# EasyEDA Pro project ProPrj_StarrySkyPi_2025-06-18.epro, schematic Schematic1, sheets 1 to 5 of 7

## Sheets
1 设计概览: Board Name: Board1; Create Date: 2025-06-05; Page Name: 设计概览; Project Name: StarrySkyPi; Schematic Name: Schematic1; Update Date: 2025-06-05; Company: 嘉立创EDA; Page Size: A4; Version: V1.0
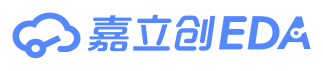
[diagram p0: 设计概览]
2 电源模块: Page Name: 电源模块
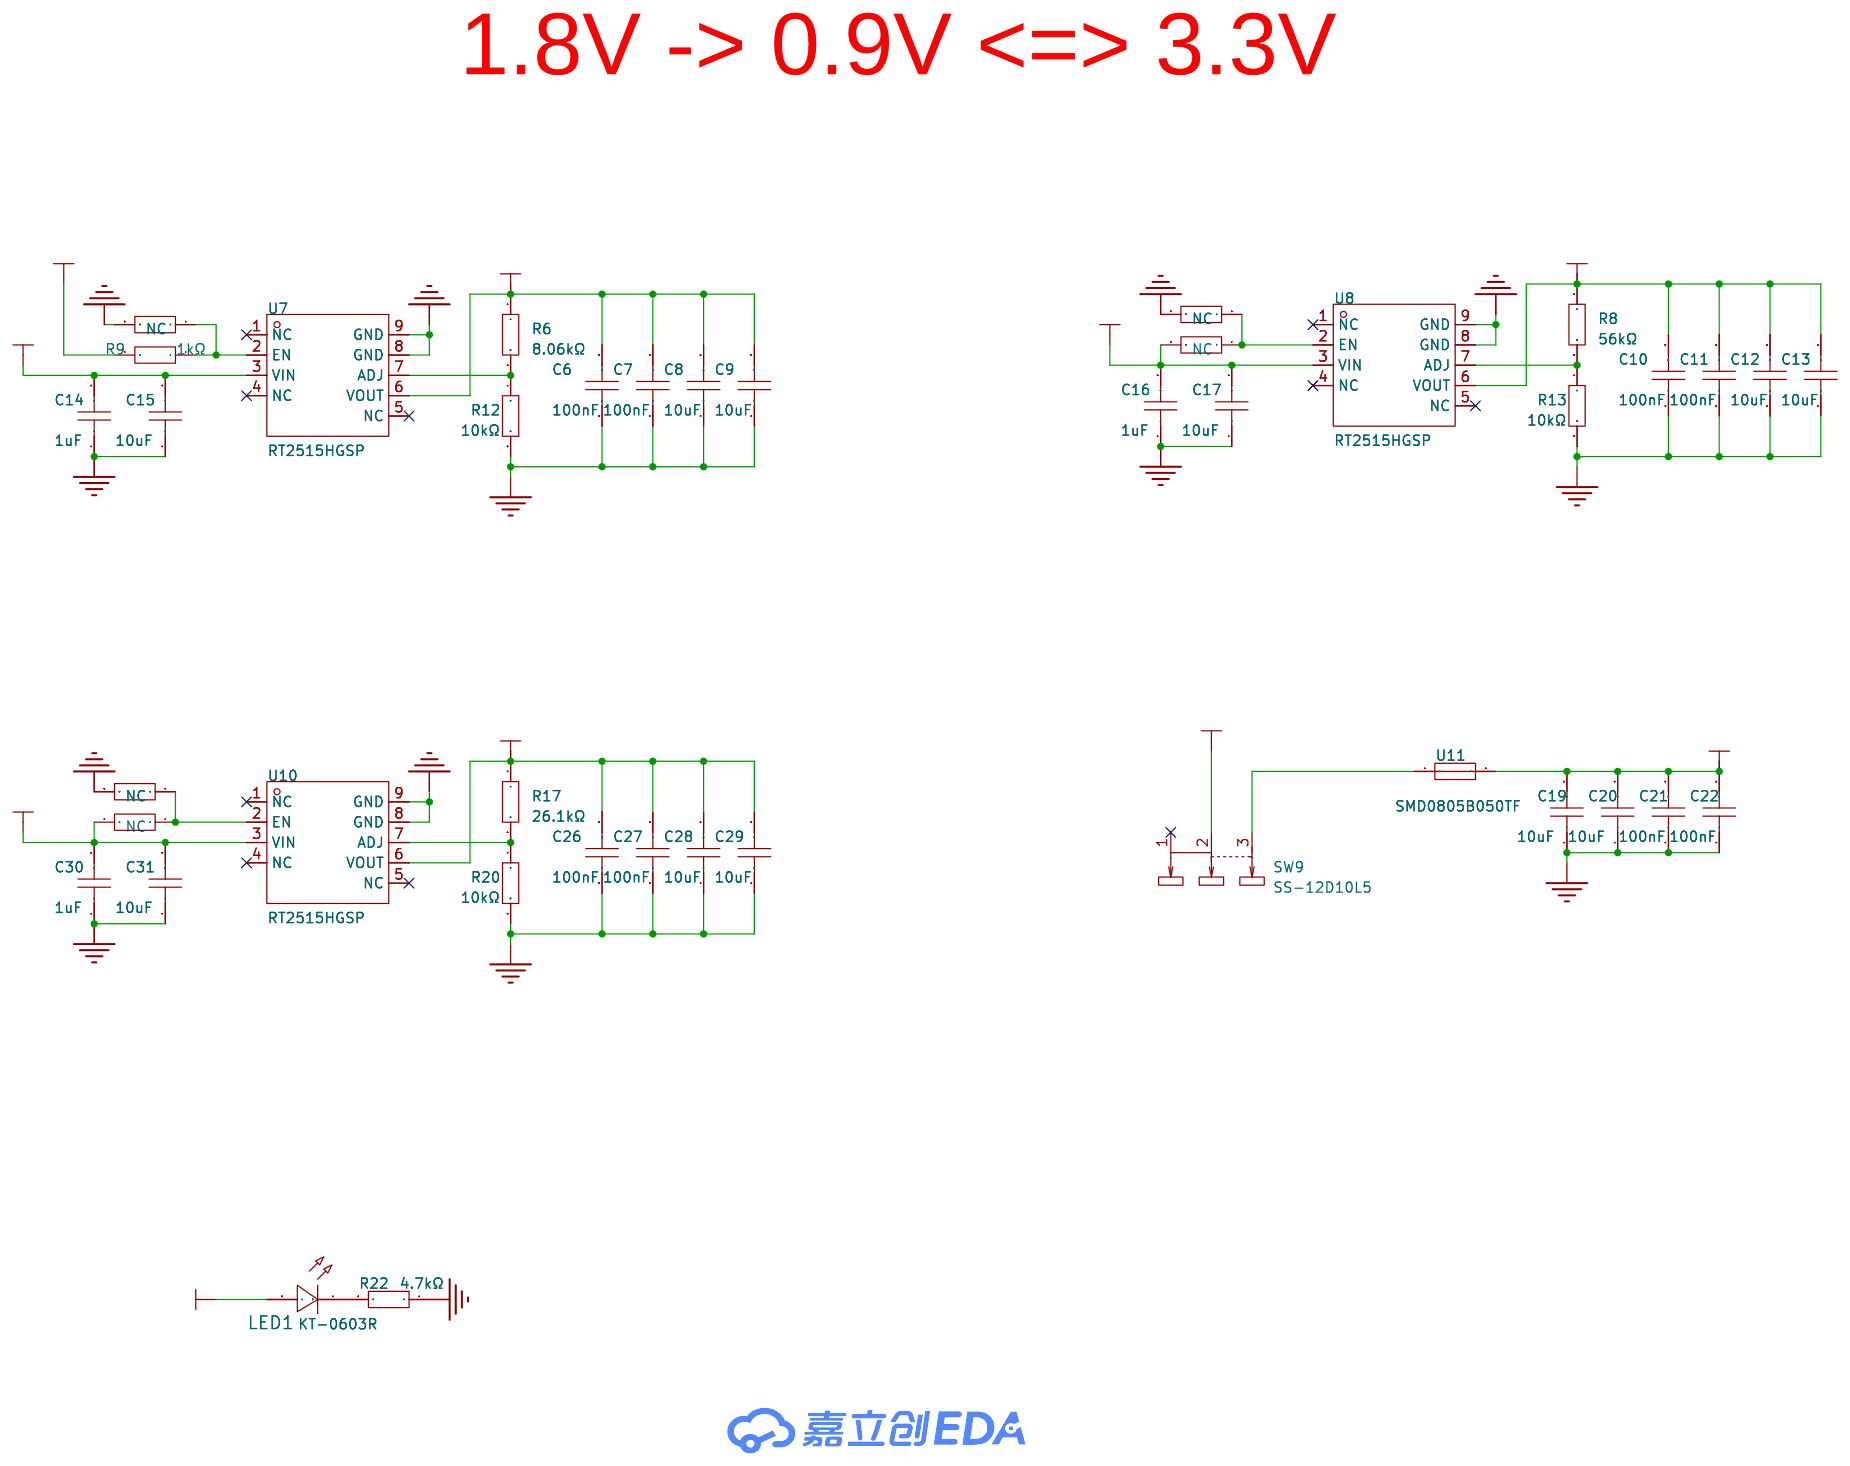
[diagram p1: 电源模块]
3 芯片外围: Page Name: 芯片外围
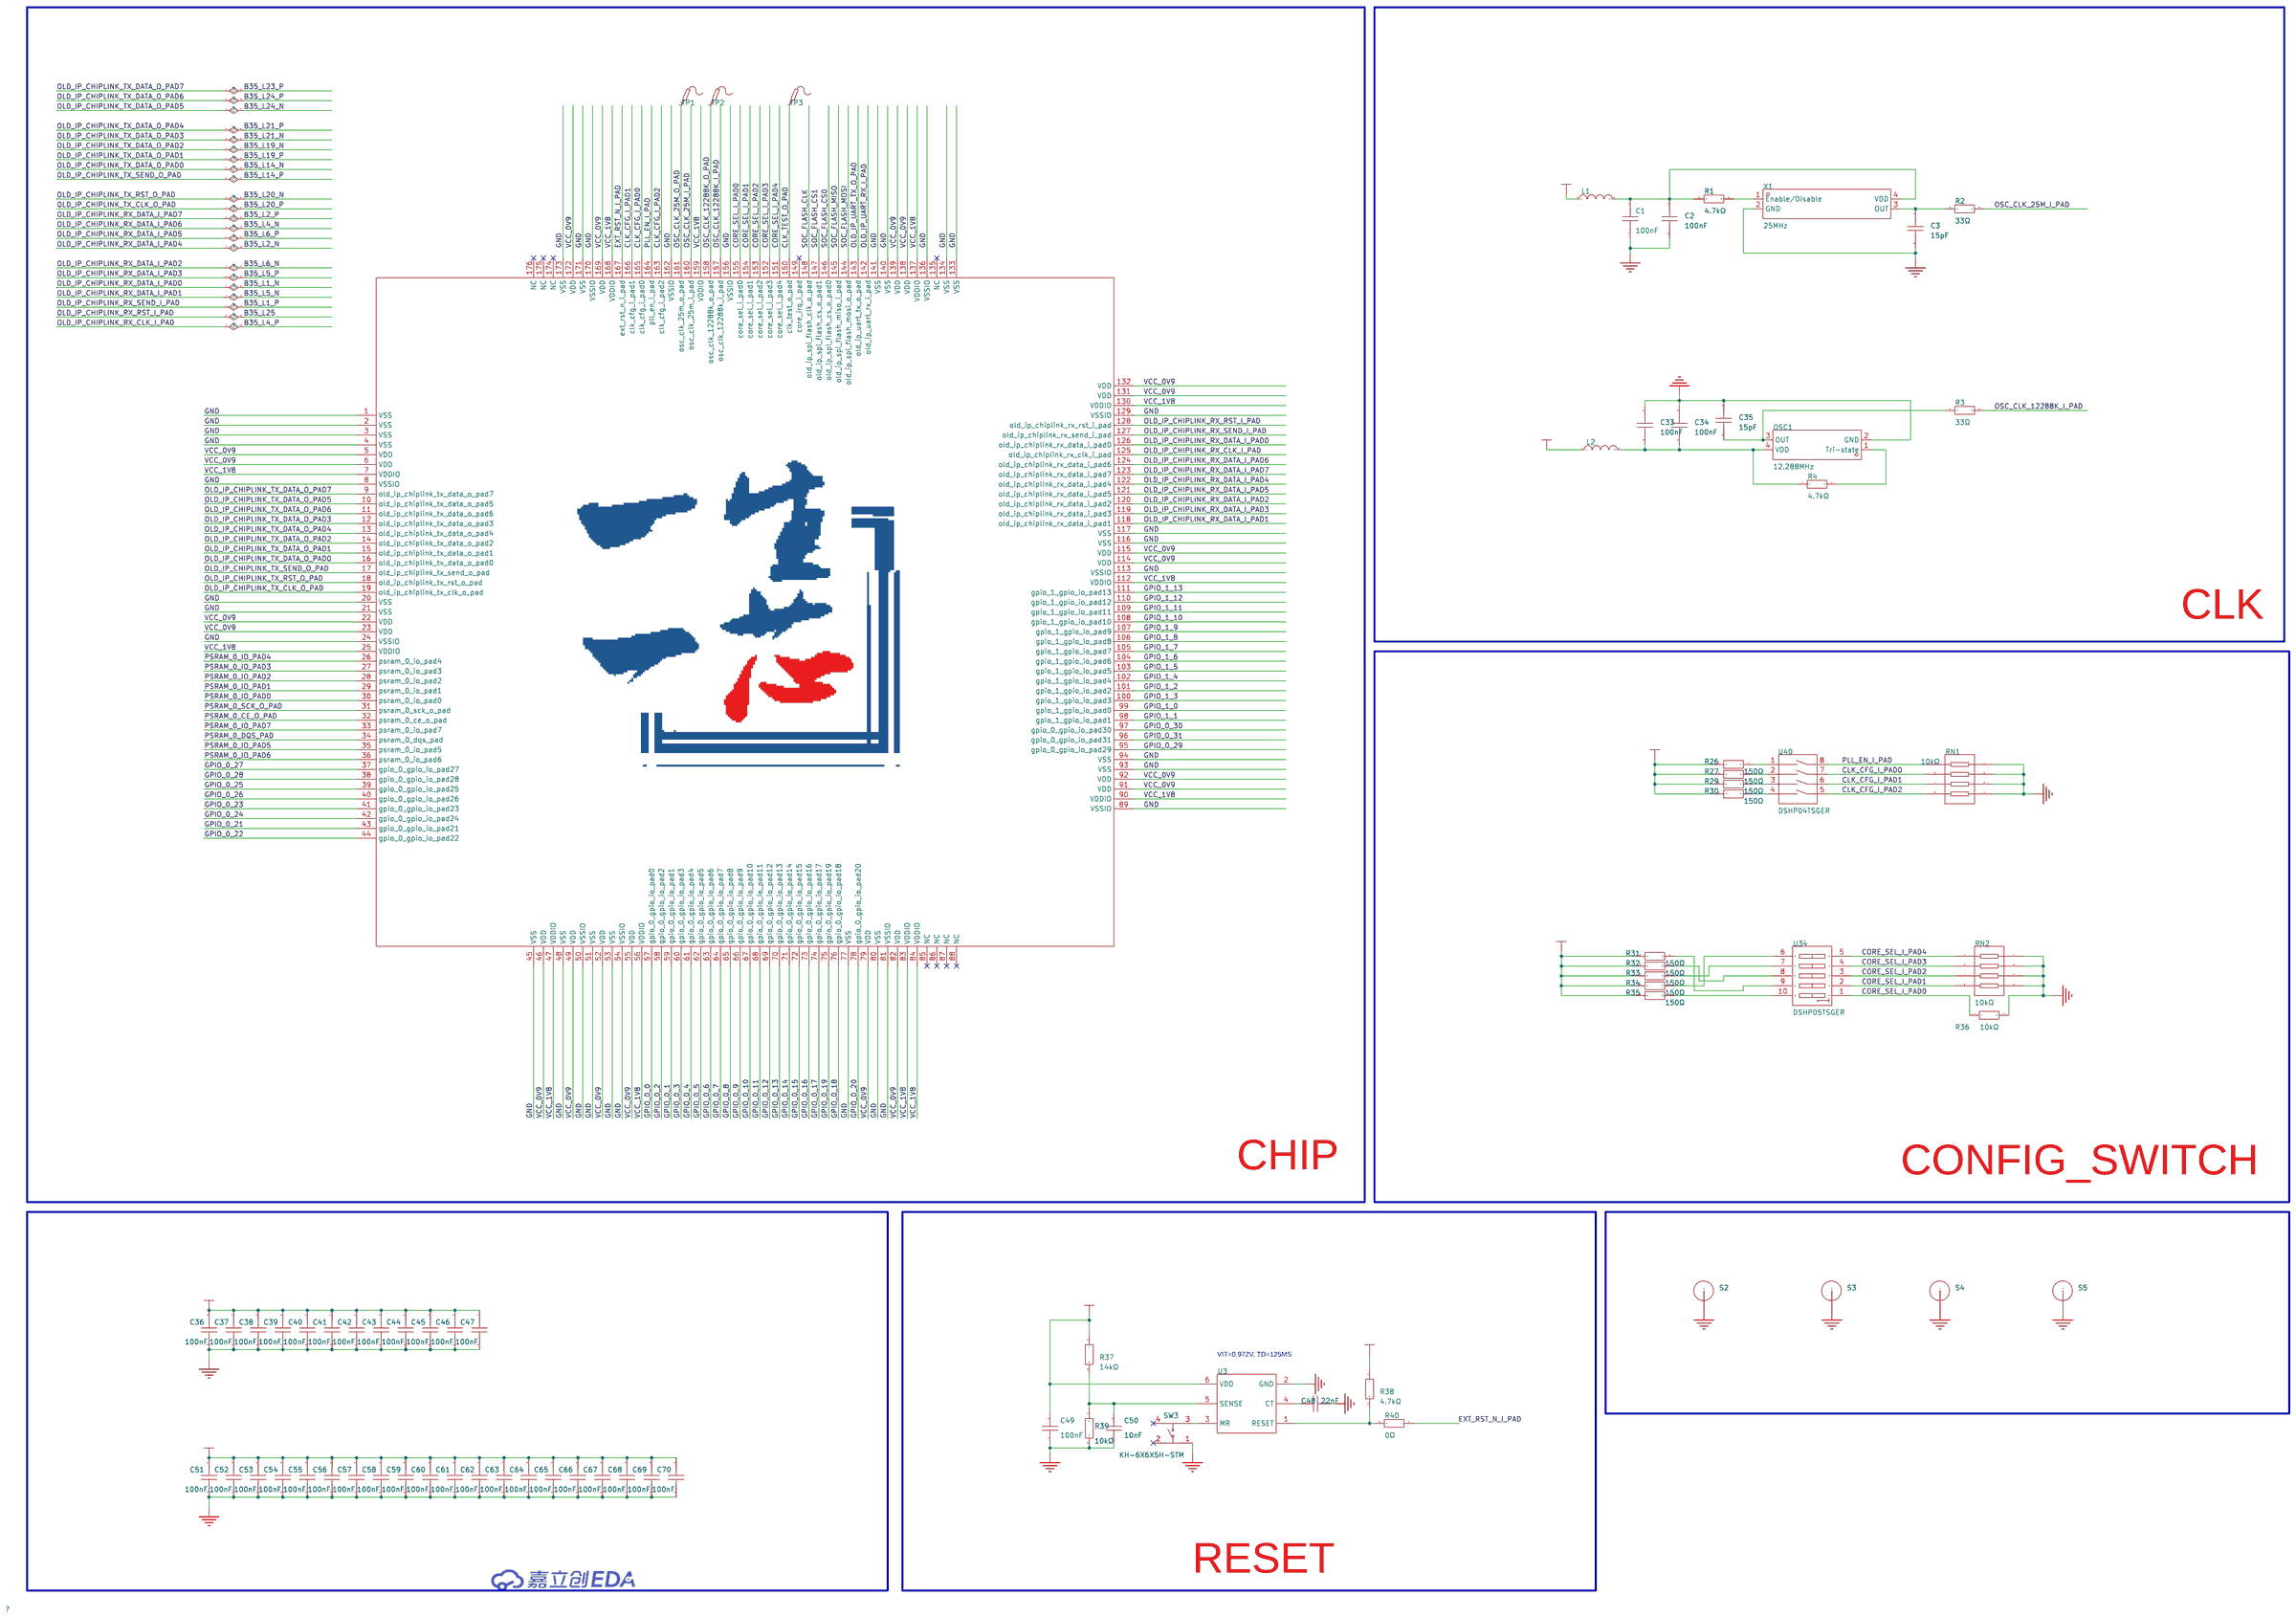
[diagram p2: 芯片外围]
4 FPGA外围: Page Name: FPGA外围
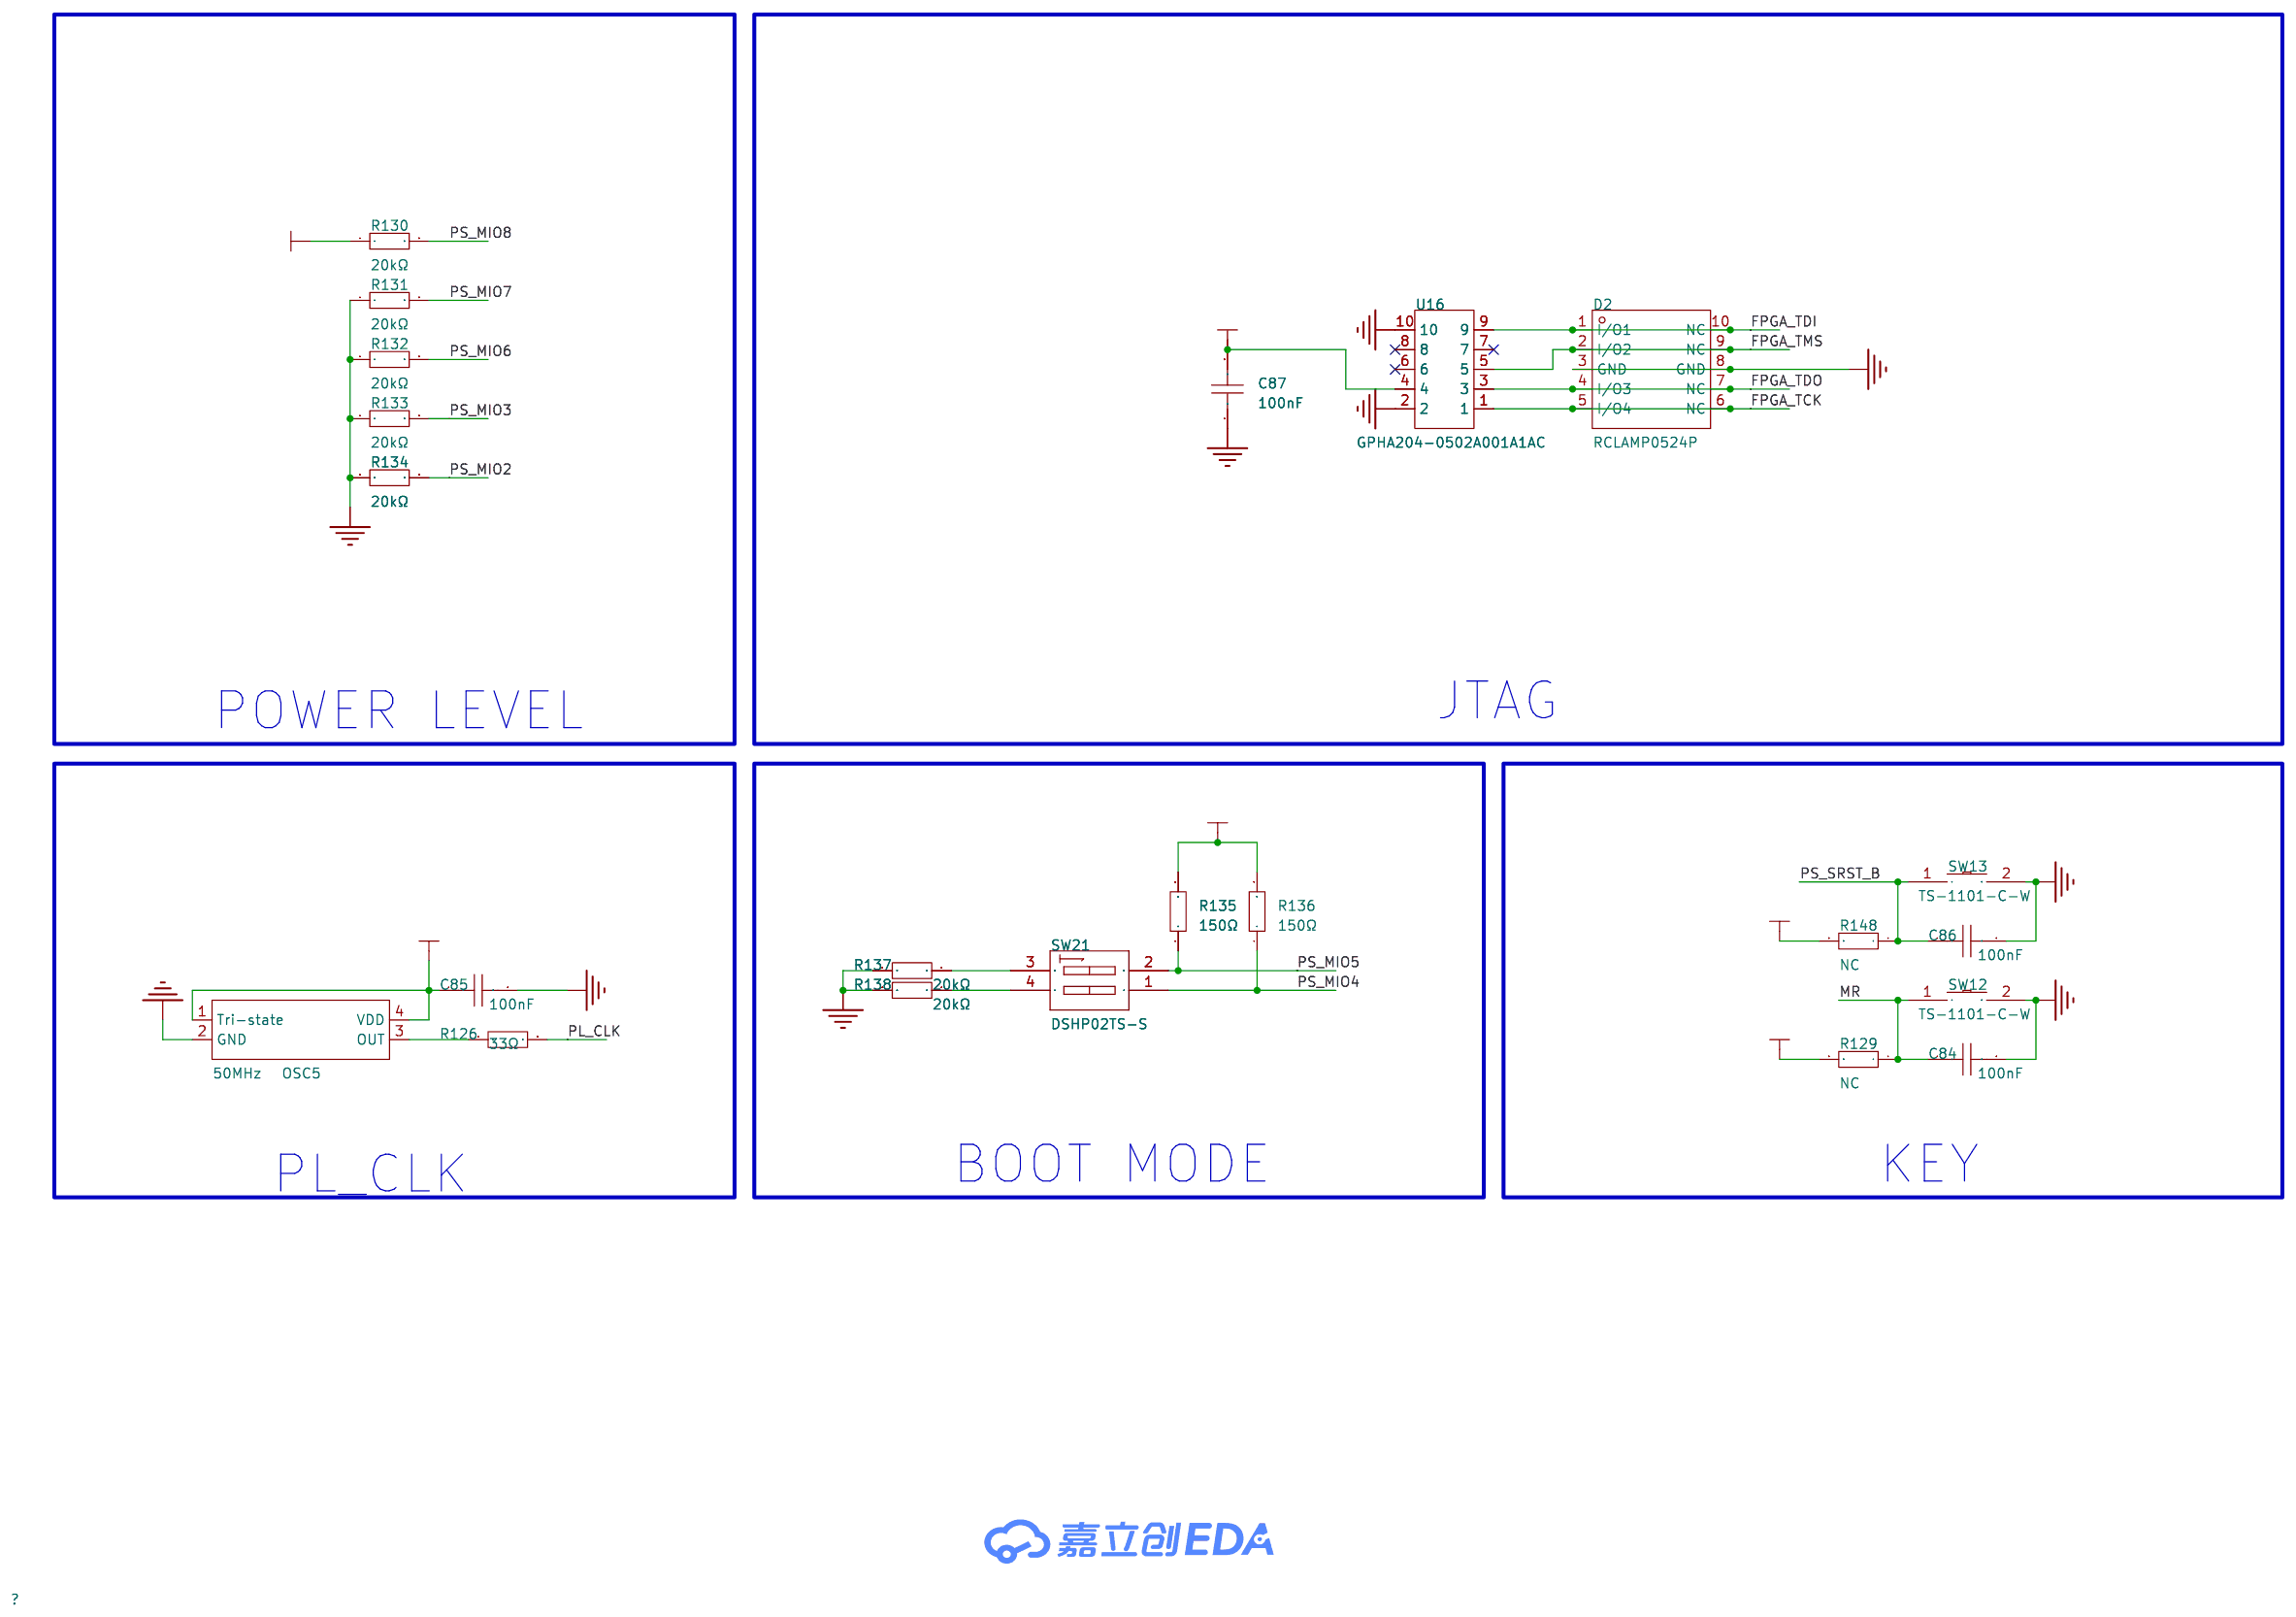
[diagram p3: FPGA外围]
5 接口电路: Page Name: 接口电路
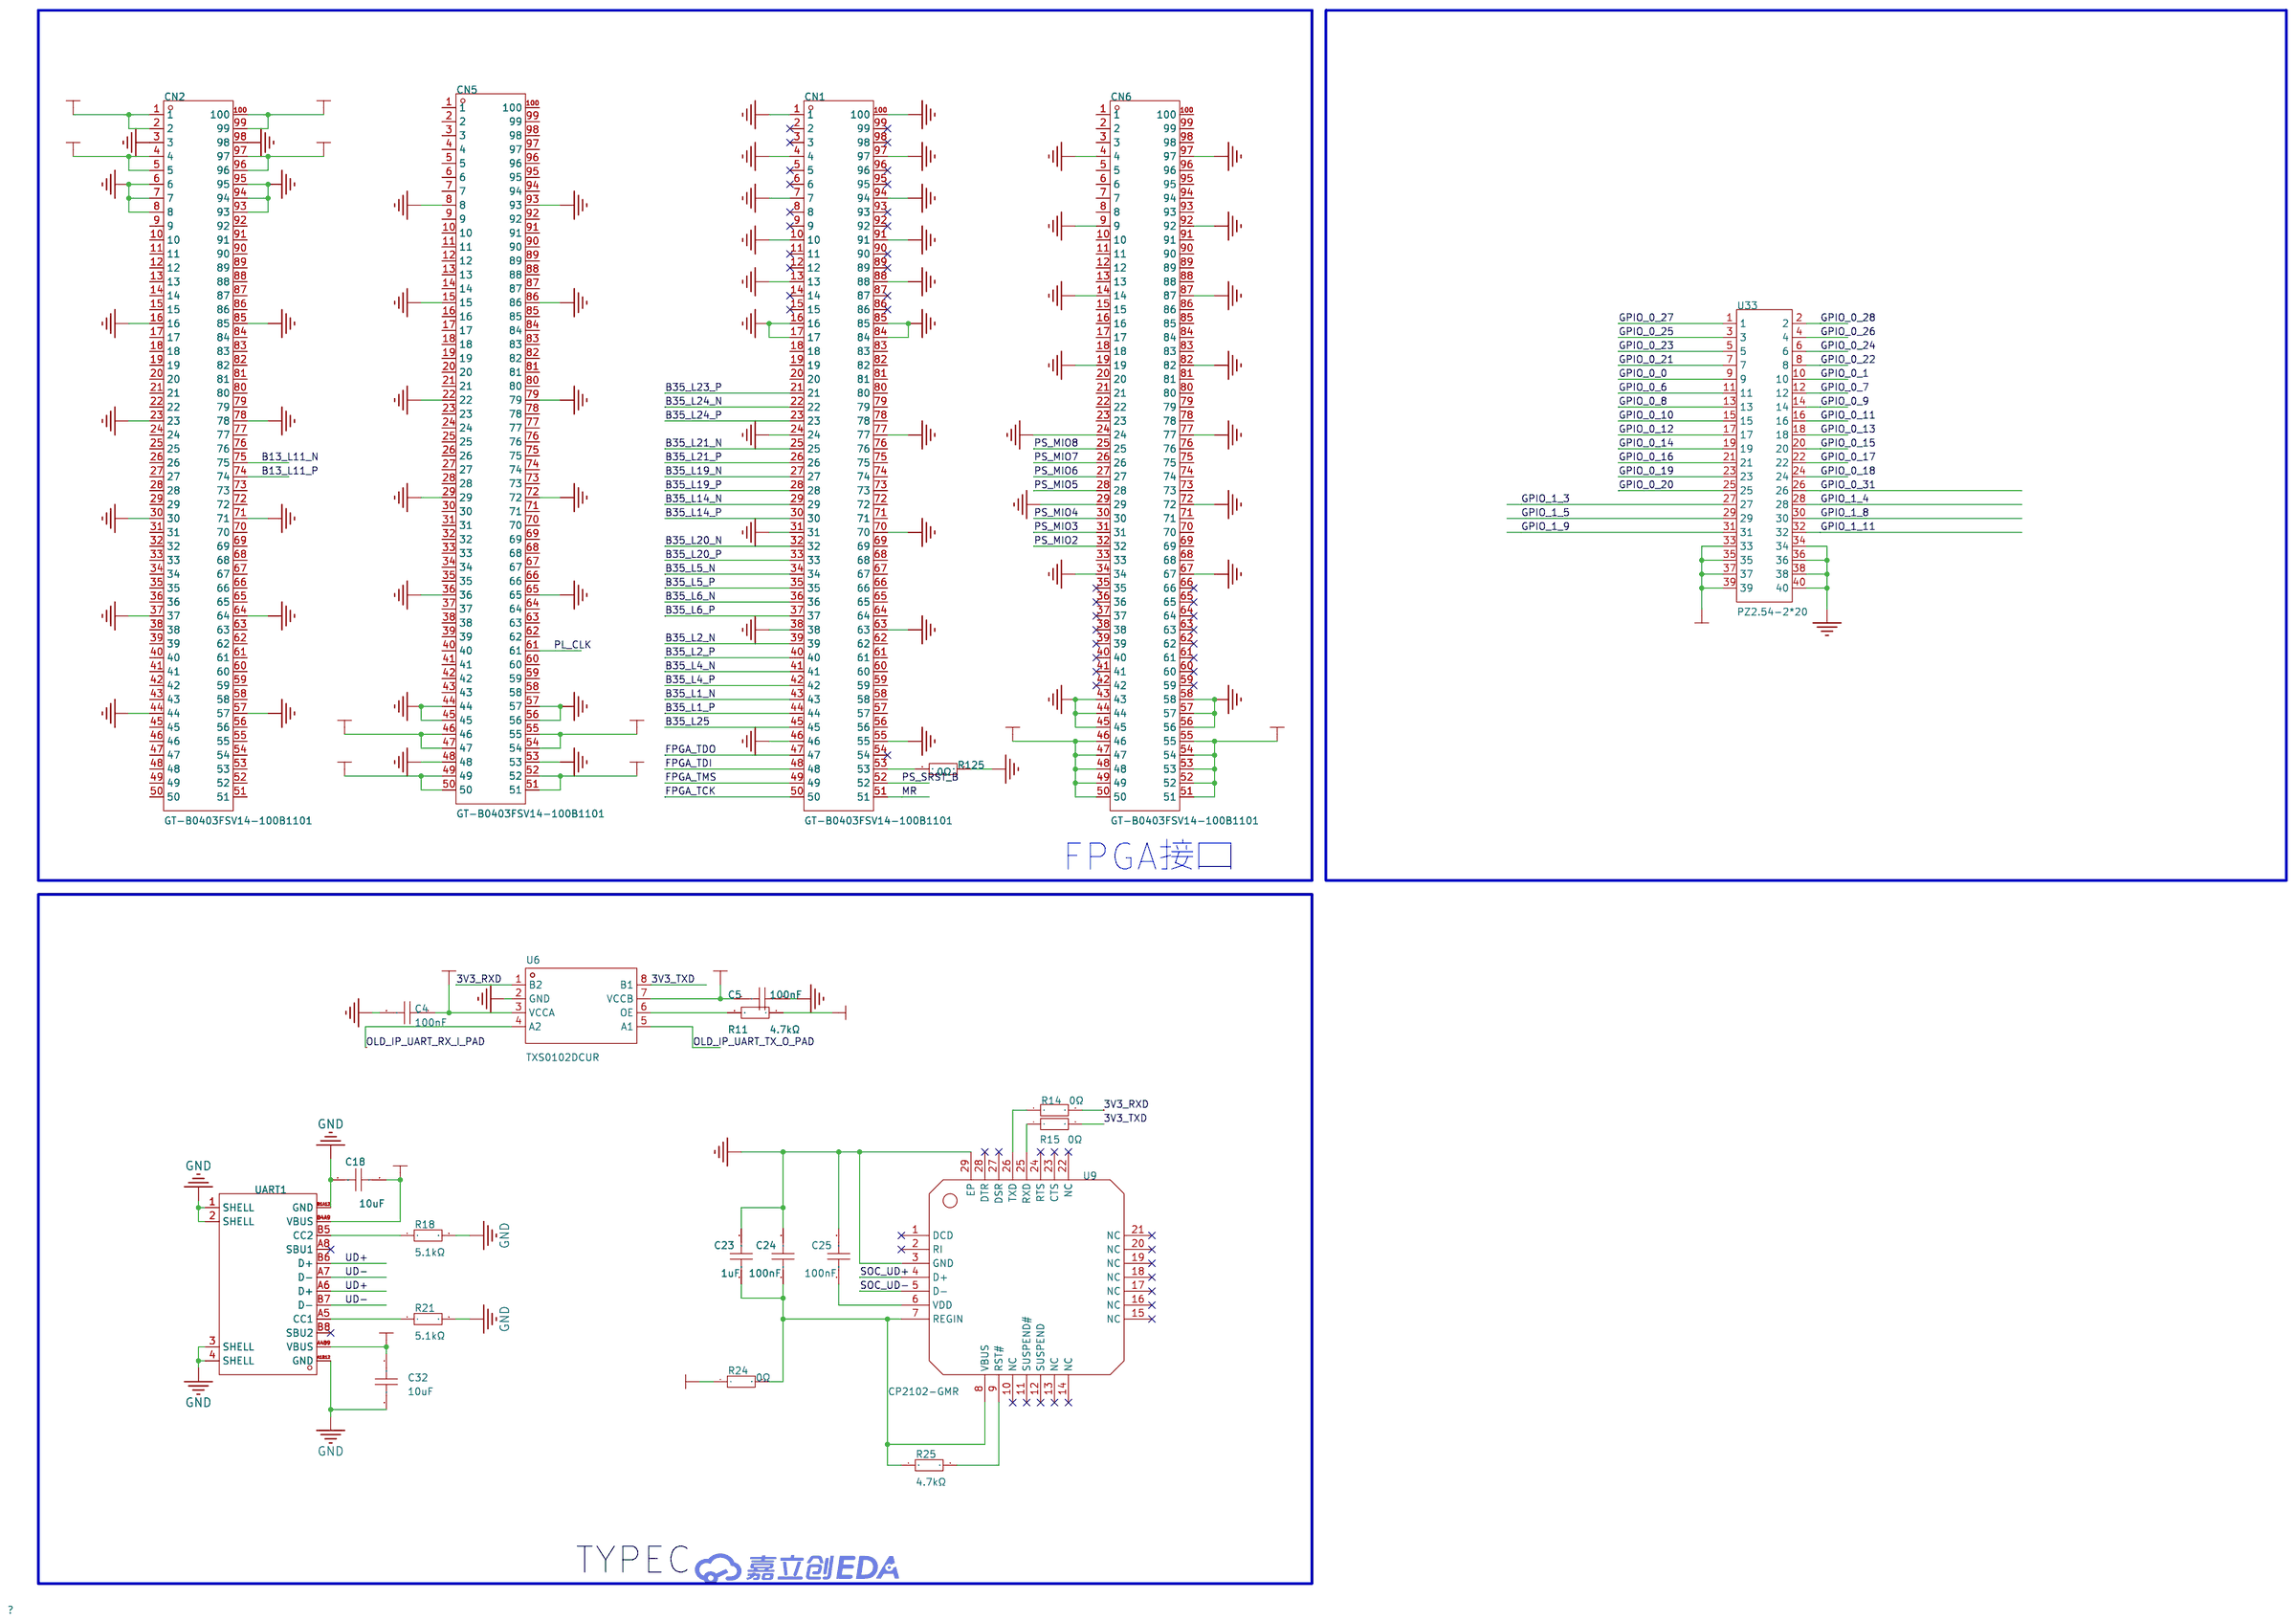
[diagram p4: 接口电路]

## Parts
sheet FPGA外围
C84  100nF  [C0402]
C85  100nF  [C0402]
C86  100nF  [C0402]
C87  100nF  [C0402]
D2  RCLAMP0524P  [DFN2510-10_L2.5-W1.0-P0.50-BL]
OSC5  50MHz  [OSC-SMD_4P-L3.2-W2.5-BL]
R126  33Ω  [R0402]
R129  NC  [R0402]
R130  20kΩ  [R0201]
R131  20kΩ  [R0201]
R132  20kΩ  [R0201]
R133  20kΩ  [R0201]
R134  20kΩ  [R0201]
R135  150Ω  [R0402]
R136  150Ω  [R0402]
R137  20kΩ  [R0402]
R138  20kΩ  [R0402]
R148  NC  [R0402]
SW12  TS-1101-C-W  [SW-SMD_L6.0-W3.3-LS8.0]
SW13  TS-1101-C-W  [SW-SMD_L6.0-W3.3-LS8.0]
SW21  DSHP02TS-S  [SW-SMD_DSHP02TS-S]
U16  GPHA204-0502A001A1AC  [HDR-TH_10P-P2.54-V-F-R2-C5-S2.54_GREENCONN]
sheet 接口电路
C4  100nF  [C0402]
C5  100nF  [C0402]
C18  10uF  [C0402]
C23  1uF  [C0402]
C24  100nF  [C0402]
C25  100nF  [C0402]
C32  10uF  [C0402]
CN1  GT-B0403FSV14-100B1101  [CONN-SMD_100P-P0.40_GT-B0403FSV24-100B1101]
CN2  GT-B0403FSV14-100B1101  [CONN-SMD_100P-P0.40_GT-B0403FSV24-100B1101]
CN5  GT-B0403FSV14-100B1101  [CONN-SMD_100P-P0.40_GT-B0403FSV24-100B1101]
CN6  GT-B0403FSV14-100B1101  [CONN-SMD_100P-P0.40_GT-B0403FSV24-100B1101]
R11  4.7kΩ  [R0402]
R14  0Ω  [R0402]
R15  0Ω  [R0402]
R18  5.1kΩ  [R0402]
R21  5.1kΩ  [R0402]
R24  0Ω  [R0402]
R25  4.7kΩ  [R0402]
R125  0Ω  [R0402]
U6  TXS0102DCUR  [VSON8_L2.0-W2.3-P0.50-LS3.1-BL]
U9  CP2102-GMR  [WQFN-28_L5.0-W5.0-P0.50-BL-EP3.2]
U33  PZ2.54-2*20  [HDR-TH_40P-P2.54-V-M-R2-C20-S2.54]
UART1  -  [USB-C-SMD_G-SWITCH_GT-USB-7010EN]
sheet 电源模块
C6  100nF  [C0402]
C7  100nF  [C0402]
C8  10uF  [C0402]
C9  10uF  [C0402]
C10  100nF  [C0402]
C11  100nF  [C0402]
C12  10uF  [C0402]
C13  10uF  [C0402]
C14  1uF  [C0402]
C15  10uF  [C0402]
C16  1uF  [C0402]
C17  10uF  [C0402]
C19  10uF  [C0402]
C20  10uF  [C0402]
C21  100nF  [C0402]
C22  100nF  [C0402]
C26  100nF  [C0402]
C27  100nF  [C0402]
C28  10uF  [C0402]
C29  10uF  [C0402]
C30  1uF  [C0402]
C31  10uF  [C0402]
LED1  KT-0603R  [LED0603-RD]
R5  NC  [R0402]
R6  8.06kΩ  [R0402]
R7  NC  [R0402]
R8  56kΩ  [R0402]
R9  1kΩ  [R0402]
R10  NC  [R0402]
R12  10kΩ  [R0402]
R13  10kΩ  [R0402]
R16  NC  [R0402]
R17  26.1kΩ  [R0402]
R19  NC  [R0402]
R20  10kΩ  [R0402]
R22  4.7kΩ  [R0402]
SW9  SS-12D10L5  [SW-TH_SS-12D10L5]
U7  RT2515HGSP  [SOP-8_L4.9-W3.9-P1.27-LS6.0-BL-EP]
U8  RT2515HGSP  [SOP-8_L4.9-W3.9-P1.27-LS6.0-BL-EP]
U10  RT2515HGSP  [SOP-8_L4.9-W3.9-P1.27-LS6.0-BL-EP]
U11  SMD0805B050TF  [F0805]
sheet 芯片外围
C1  100nF  [C0402]
C2  100nF  [C0402]
C3  15pF  [C0402]
C33  100nF  [C0402]
C34  100nF  [C0402]
C35  15pF  [C0402]
C36  100nF  [C0201]
C37  100nF  [C0201]
C38  100nF  [C0201]
C39  100nF  [C0201]
C40  100nF  [C0201]
C41  100nF  [C0201]
C42  100nF  [C0201]
C43  100nF  [C0201]
C44  100nF  [C0201]
C45  100nF  [C0201]
C46  100nF  [C0201]
C47  100nF  [C0201]
C48  22nF  [C0402]
C49  100nF  [C0402]
C50  10nF  [C0402]
C51  100nF  [C0201]
C52  100nF  [C0201]
C53  100nF  [C0201]
C54  100nF  [C0201]
C55  100nF  [C0201]
C56  100nF  [C0201]
C57  100nF  [C0201]
C58  100nF  [C0201]
C59  100nF  [C0201]
C60  100nF  [C0201]
C61  100nF  [C0201]
C62  100nF  [C0201]
C63  100nF  [C0201]
C64  100nF  [C0201]
C65  100nF  [C0201]
C66  100nF  [C0201]
C67  100nF  [C0201]
C68  100nF  [C0201]
C69  100nF  [C0201]
C70  100nF  [C0201]
L1  CBW201209U601T  [L0805]
L2  CBW201209U601T  [L0805]
OSC1  12.288MHz  [OSC-SMD_4P-L3.2-W2.5-BL]
R1  4.7kΩ  [R0402]
R2  33Ω  [R0402]
R3  33Ω  [R0402]
R4  4.7kΩ  [R0402]
R26  150Ω  [R0402]
R27  150Ω  [R0402]
R29  150Ω  [R0402]
R30  150Ω  [R0402]
R31  150Ω  [R0402]
R32  150Ω  [R0402]
R33  150Ω  [R0402]
R34  150Ω  [R0402]
R35  150Ω  [R0402]
R36  10kΩ  [R0402]
R37  14kΩ  [R0402]
R38  4.7kΩ  [R0402]
R39  10kΩ  [R0402]
R40  0Ω  [R0402]
RN1  10kΩ  [RES-ARRAY-SMD_0603-8P-L3.2-W1.6-BL]
RN2  10kΩ  [RES-ARRAY-SMD_0603-8P-L3.2-W1.6-BL]
S2  M3  [m3 125x300]
S3  M3  [m3 125x300]
S4  M3  [m3 125x300]
S5  M3  [m3 125x300]
SW3  KH-6X6X5H-STM  [SW-SMD_4P-L6.0-W6.0-P4.50-LS9.0-2]
TP1  -  [Test-Point-0.5mm]
TP2  -  [Test-Point-0.5mm]
TP3  -  [Test-Point-0.5mm]
U1  -  [LQPF 176 20*20]
U3  TPS3808G01DBVR  [SOT-23-6_L2.9-W1.6-P0.95-LS2.8-BR]
U34  DSHP05TSGER  [SW-SMD_10P-P1.27-L7.8-W5.4]
U40  DSHP04TSGER  [SW-SMD_8P-L6.7-W5.4-P1.27-LS8.4]
X1  25MHz  [OSC-SMD_4P-L3.2-W2.5-BL]

## Library data of the parts
C4 C5 C84 C86 = CL05B104KO5NNNC: 容值:100nF;精度:±10%;额定电压:16V;材质(温度系数):X7R;; LCSC Part Name: 100nF ±10% 16V; Supplier Part: C1525; Manufacturer: SAMSUNG(三星); Supplier Footprint: 0402; JLCPCB Part Class: Basic Part; Datasheet: https://atta.szlcsc.com/upload/public/pdf/source/20160218/1457707763339.pdf; Supplier: LCSC; Tolerance: ±10%; Voltage Rated: 16V; Temperature Coefficient: X7R
C1 C2 C6 C7 C10 C11 C21 C22 C26 C27 C33 C34 C85 = CL05B104KB54PNC: 容值:100nF;精度:±10%;额定电压:50V;材质(温度系数):X7R;; LCSC Part Name: 100nF ±10% 50V; Supplier Part: C307331; Manufacturer: SAMSUNG(三星); Supplier Footprint: 0402; JLCPCB Part Class: Basic Part; Datasheet: https://atta.szlcsc.com/upload/public/pdf/source/20160218/1457707763339.pdf; Supplier: LCSC; Tolerance: ±10%; Voltage Rated: 50V; Temperature Coefficient: X7R
C87 = GRM155R71H104KE14D: 容值:100nF;精度:±10%;额定电压:50V;材质(温度系数):X7R;; LCSC Part Name: 100nF ±10% 50V; Supplier Part: C77020; Manufacturer: muRata(村田); Supplier Footprint: 0402; JLCPCB Part Class: Extended Part; Datasheet: https://atta.szlcsc.com/upload/public/pdf/source/20180326/C77020_39BD49C951FF1AF0DB1F1FAC5AC1E401.pdf; Supplier: LCSC; Tolerance: ±10%; Voltage Rated: 50V; Temperature Coefficient: X7R
D2 = RCLAMP0524P_C907837: 极性:单向;反向截止电压(Vrwm):5V;最大钳位电压:17V;峰值脉冲电流(Ipp):4.5A;击穿电压:6.8V;; Supplier Part: C907837; Manufacturer: TECH PUBLIC(台舟); Supplier Footprint: DFN2510-10; JLCPCB Part Class: 扩展库; Datasheet: https://atta.szlcsc.com/upload/public/pdf/source/20210810/AE3DE9AC94AD2A317FD9BEA10653400F.pdf; Supplier: LCSC; polarity: 单向; Reverse Stand-Off Voltage (Vrwm): 5V; Maximum Clamping Voltage: 17V; Peak Pulse Current (Ipp): 4.5A; Breakdown Voltage: 6.8V; Reverse Leakage Current (Ir): 80nA; Number of Lines: 四路; Operating Temperature: -55℃~+125℃; level of protection: IEC 61000-4-2; Type: ESD
OSC5 = OT2EL4C4JI-111OLP-50M: 频率:50MHz;常温频差:±10ppm;输出模式:CMOS;工作电压:1.8V~3.3V;频率稳定度:±20ppm;; LCSC Part Name: 50MHZ 1.8V-3.3V ±10PPM YSO110TR; Supplier Part: C5203552; Manufacturer: YXC(扬兴晶振); Supplier Footprint: SMD3225-4P; JLCPCB Part Class: 扩展库; Datasheet: https://atta.szlcsc.com/upload/public/pdf/source/20240731/596E5F7673E50DA744B7F79F139FB8DF.pdf; Supplier: LCSC; Normal temperature Frequency Tolerance: ±10ppm; Output Type: CMOS; Voltage - Supply: 1.8V~3.3V; Frequency Stability: ±20ppm; Operating Temperature: -40℃~+85℃
R2 R3 R126 = 0402WGF330JTCE: 电阻类型:厚膜电阻;阻值:33Ω;精度:±1%;功率:62.5mW;最大工作电压:50V;温度系数:±100ppm/℃;; LCSC Part Name: 33Ω ±1% 62.5mW 厚膜电阻; Supplier Part: C25105; Manufacturer: UNI-ROYAL(厚声); Supplier Footprint: 0402; JLCPCB Part Class: Basic Part; Datasheet: https://atta.szlcsc.com/upload/public/pdf/source/20200306/C422600_1E6D84923E4A46A82E41ADD87F860B5C.pdf; Supplier: LCSC; Type: 厚膜电阻; Tolerance: ±1%; Power(Watts): 62.5mW; Overload Voltage (Max): 50V; Temperature Coefficient: ±100ppm/℃; Operating Temperature Range: -55℃~+155℃
R129 R148 = Res_0402: Supplier Footprint: 0402; Check: false
R130-R134 = 0201WMF2002TEE: 电阻类型:厚膜电阻;阻值:20kΩ;精度:±1%;功率:50mW;最大工作电压:25V;温度系数:±200ppm/℃;; LCSC Part Name: 20kΩ ±1% 50mW 厚膜电阻; Supplier Part: C473466; Manufacturer: UNI-ROYAL(厚声); Supplier Footprint: 0201; JLCPCB Part Class: Extended Part; Datasheet: https://atta.szlcsc.com/upload/public/pdf/source/20200306/C422600_1E6D84923E4A46A82E41ADD87F860B5C.pdf; Supplier: LCSC; Type: 厚膜电阻; Tolerance: ±1%; Power(Watts): 50mW; Overload Voltage (Max): 25V; Temperature Coefficient: ±200ppm/℃; Operating Temperature Range: -55℃~+155℃
R26 R27 R29-R35 R135 R136 = 0402WGF1500TCE: 电阻类型:厚膜电阻;阻值:150Ω;精度:±1%;功率:62.5mW;最大工作电压:50V;温度系数:±100ppm/℃;; LCSC Part Name: 150Ω ±1% 62.5mW 厚膜电阻; Supplier Part: C25082; Manufacturer: UNI-ROYAL(厚声); Supplier Footprint: 0402; JLCPCB Part Class: Extended Part; Datasheet: https://atta.szlcsc.com/upload/public/pdf/source/20200306/C422600_1E6D84923E4A46A82E41ADD87F860B5C.pdf; Supplier: LCSC; Type: 厚膜电阻; Tolerance: ±1%; Power(Watts): 62.5mW; Overload Voltage (Max): 50V; Temperature Coefficient: ±100ppm/℃; Operating Temperature Range: -55℃~+155℃
R137 R138 = 0402WGF2002TCE: 电阻类型:厚膜电阻;阻值:20kΩ;精度:±1%;功率:62.5mW;最大工作电压:50V;温度系数:±100ppm/℃;; LCSC Part Name: 20kΩ ±1% 62.5mW 厚膜电阻; Supplier Part: C25765; Manufacturer: UNI-ROYAL(厚声); Supplier Footprint: 0402; JLCPCB Part Class: Basic Part; Datasheet: https://atta.szlcsc.com/upload/public/pdf/source/20200306/C422600_1E6D84923E4A46A82E41ADD87F860B5C.pdf; Supplier: LCSC; Type: 厚膜电阻; Tolerance: ±1%; Power(Watts): 62.5mW; Overload Voltage (Max): 50V; Temperature Coefficient: ±100ppm/℃; Operating Temperature Range: -55℃~+155℃
SW12 SW13 = TS-1101-C-W: 电路结构:单刀单掷;按钮形状:矩形按钮;作用力:260gf;安装方式:立贴;开关长度:6mm;开关宽度:3.6mm;开关高度:2.5mm;带支架:不带;触点电流:50mA;额定电压(AC):-;额定电压(DC):12V;额定功率:-;绝缘电阻:-;带灯:无;机械寿命:5万次;; LCSC Part Name: 6*3.6*2.5mm 立贴 轻触开关; Supplier Part: C318938; Manufacturer: XKB Connectivity(中国星坤); Supplier Footprint: SMD; JLCPCB Part Class: 扩展库; Datasheet: https://atta.szlcsc.com/upload/public/pdf/source/20200227/C318938_C2E53B1EEDE37D980A33616AC086DE53.pdf; Supplier: LCSC; Circuit: 单刀单掷; Actuator Style: 矩形按钮; Operating Force: 260gf; Mounting Style: 立贴; Switch Length: 6mm; Switch Width: 3.6mm; Switch Height: 2.5mm; Strike Gundam: 不带; Contact Current: 50mA; Voltage Rating (DC): 12V; Actuator/Cap Color: 白色带淡绿; With Lamp: 无; Mechanical Life: 5万次; Operating Temperature: -30℃~+85℃
SW21 = DSHP02TS-S: 类型:平拨,凹槽式;电路结构:单刀单掷;开关位数:2位;额定电流:25mA;额定电压:24V;使用寿命:3千次;颜色:黑色;; LCSC Part Name: 间距1.27mm 平拨,凹槽式 2位拨码开关; Supplier Part: C319052; Manufacturer: XKB Connectivity(中国星坤); Supplier Footprint: SMD-4P,4.1x5.4mm; JLCPCB Part Class: 扩展库; Datasheet: https://atta.szlcsc.com/upload/public/pdf/source/20211009/11BE85C99D2C85B0991AF4F9D6EB8BDE.pdf; Supplier: LCSC; Type: 平拨,凹槽式; Circuit: 单刀单掷; Number of Positions: 2位; Pin Style: 鸥翼型; Lead Pitch: 1.27mm; Current Rating: 25mA; Voltage Rating: 24V; Operating Temperature: -20℃~+70℃; Operating Life: 3千次; Color: 黑色
U16 = GPHA204-0502A001A1AC: 插针结构:2x5P;间距:2.54mm;行距:2.54mm;圆针/方针:方针;安装方式:直插;排数:双排;总PIN位数:10P;额定电流:3A;工作温度:-40℃~+105℃;; LCSC Part Name: 2x5P 间距:2.54mm 方针 直插; Supplier Part: C7434489; Manufacturer: GREENCONN(格康); Supplier Footprint: 插件,P=2.54mm; JLCPCB Part Class: 扩展库; Datasheet: https://atta.szlcsc.com/upload/public/pdf/source/20230629/5219912619087175F360FB077FF4D3A7.pdf; Supplier: LCSC; Pin Structure: 2x5P; Pitch: 2.54mm; Row Spacing: 2.54mm; Circluar Pins/Square Pins: 方针; Mounting Type: 直插; Number of Rows: 双排; Number of Pins: 10P; Current Rating: 3A; Operating Temperature: -40℃~+105℃
C8 C9 C12 C13 C15 C17-C20 C28 C29 C31 C32 = HGC0402R5106M100NTEJ: 容值:10uF;精度:±20%;额定电压:10V;材质(温度系数):X5R;; LCSC Part Name: 10uF ±20% 10V; Supplier Part: C7472949; Manufacturer: Chinocera(华瓷); Supplier Footprint: 0402; JLCPCB Part Class: Extended Part; Datasheet: https://atta.szlcsc.com/upload/public/pdf/source/20240320/FAC3FEC40A78BC5CCCE96C232A94D860.pdf; Supplier: LCSC; Tolerance: ±20%; Voltage Rated: 10V; Temperature Coefficient: X5R
C14 C16 C23 C30 = CL05A105KA5NQNC: 容值:1uF;精度:±10%;额定电压:25V;材质(温度系数):X5R;; LCSC Part Name: 1uF ±10% 25V; Supplier Part: C52923; Manufacturer: SAMSUNG(三星); Supplier Footprint: 0402; JLCPCB Part Class: Basic Part; Datasheet: https://atta.szlcsc.com/upload/public/pdf/source/20160218/1457707763339.pdf; Supplier: LCSC; Tolerance: ±10%; Voltage Rated: 25V; Temperature Coefficient: X5R
C24 C25 C49 = CC0402KRX7R7BB104: 容值:100nF;精度:±10%;额定电压:16V;材质(温度系数):X7R;; LCSC Part Name: 100nF ±10% 16V; Supplier Part: C60474; Manufacturer: YAGEO(国巨); Supplier Footprint: 0402; JLCPCB Part Class: Extended Part; Datasheet: https://atta.szlcsc.com/upload/public/pdf/source/20211223/9278FD768280B81DDBEF48FA36411A03.pdf; Supplier: LCSC; Tolerance: ±10%; Voltage Rated: 16V; Temperature Coefficient: X7R
CN1 = GT-B0403FSV14-100B1101: PIN总数:100P;间距:0.4mm;安装方式:立贴;排数:2;额定电流:300mA;工作温度:-55℃~+125℃;; LCSC Part Name: PIN:100P 间距:0.4mm 立贴; Supplier Part: F; Manufacturer: G-Switch(品赞); Supplier Footprint: SMD,P=0.4mm; JLCPCB Part Class: Extended Part; Datasheet: https://atta.szlcsc.com/upload/public/pdf/source/20241104/876CF10ABFB6CA98EC52562C1B9B33BE.pdf; Supplier: LCSC; Number of Pins: 100P; Pitch: 0.4mm; Mounting Type: 立贴; Number of Rows: 2; Current Rating: 300mA; Voltage Rating: 50V; System Fit Height: 1.5mm; Contact Material: 铜; Contact Plating: 金; Operating Temperature: -55℃~+125℃
CN2 CN5 CN6 = GT-B0403FSV14-100B1101: PIN总数:100P;间距:0.4mm;安装方式:立贴;排数:2;额定电流:300mA;工作温度:-55℃~+125℃;; LCSC Part Name: PIN:100P 间距:0.4mm 立贴; Supplier Part: C42376244; Manufacturer: G-Switch(品赞); Supplier Footprint: SMD,P=0.4mm; JLCPCB Part Class: Extended Part; Datasheet: https://atta.szlcsc.com/upload/public/pdf/source/20241104/876CF10ABFB6CA98EC52562C1B9B33BE.pdf; Supplier: LCSC; Number of Pins: 100P; Pitch: 0.4mm; Mounting Type: 立贴; Number of Rows: 2; Current Rating: 300mA; Voltage Rating: 50V; System Fit Height: 1.5mm; Contact Material: 铜; Contact Plating: 金; Operating Temperature: -55℃~+125℃
R1 R4 R11 R22 R25 R38 = 0402WGF4701TCE: 电阻类型:厚膜电阻;阻值:4.7kΩ;精度:±1%;功率:62.5mW;最大工作电压:50V;温度系数:±100ppm/℃;; LCSC Part Name: 4.7kΩ ±1% 62.5mW 厚膜电阻; Supplier Part: C25900; Manufacturer: UNI-ROYAL(厚声); Supplier Footprint: 0402; JLCPCB Part Class: Basic Part; Datasheet: https://atta.szlcsc.com/upload/public/pdf/source/20200306/C422600_1E6D84923E4A46A82E41ADD87F860B5C.pdf; Supplier: LCSC; Type: 厚膜电阻; Tolerance: ±1%; Power(Watts): 62.5mW; Overload Voltage (Max): 50V; Temperature Coefficient: ±100ppm/℃; Operating Temperature Range: -55℃~+155℃
R14 R15 R24 R40 R125 = 0402WGF0000TCE: 电阻类型:厚膜电阻;阻值:0Ω;精度:±1%;功率:62.5mW;最大工作电压:50V;温度系数:±800ppm/℃;; LCSC Part Name: 0Ω ±1% 62.5mW 厚膜电阻; Supplier Part: C17168; Manufacturer: UNI-ROYAL(厚声); Supplier Footprint: 0402; JLCPCB Part Class: Basic Part; Datasheet: https://atta.szlcsc.com/upload/public/pdf/source/20200306/C422600_1E6D84923E4A46A82E41ADD87F860B5C.pdf; Supplier: LCSC; Type: 厚膜电阻; Tolerance: ±1%; Power(Watts): 62.5mW; Overload Voltage (Max): 50V; Temperature Coefficient: ±800ppm/℃; Operating Temperature Range: -55℃~+155℃
R18 R21 = 0402WGF5101TCE: 电阻类型:厚膜电阻;阻值:5.1kΩ;精度:±1%;功率:62.5mW;最大工作电压:50V;温度系数:±100ppm/℃;; LCSC Part Name: 5.1kΩ ±1% 62.5mW 厚膜电阻; Supplier Part: C25905; Manufacturer: UNI-ROYAL(厚声); Supplier Footprint: 0402; JLCPCB Part Class: Basic Part; Datasheet: https://atta.szlcsc.com/upload/public/pdf/source/20200306/C422600_1E6D84923E4A46A82E41ADD87F860B5C.pdf; Supplier: LCSC; Type: 厚膜电阻; Tolerance: ±1%; Power(Watts): 62.5mW; Overload Voltage (Max): 50V; Temperature Coefficient: ±100ppm/℃; Operating Temperature Range: -55℃~+155℃
U6 = TXS0102DCUR: 数据速率:24Mbps;电压(VCCA):1.65V~3.6V;电压(VCCB):2.3V~5.5V;电路数:1;每个电路通道数:2;; LCSC Part Name: 24Mbps 2位双向电平转换器; Supplier Part: C53434; Manufacturer: TI(德州仪器); Supplier Footprint: VSSOP-8; JLCPCB Part Class: 扩展库; Datasheet: https://www.ti.com/cn/lit/gpn/txs0102; Supplier: LCSC; Channel Type: 双向; Data Rate: 24Mbps; Supply Voltage (VCCA): 1.65V~3.6V; Supply Voltage (VCCB): 2.3V~5.5V; Number of Circuits: 1; Channels per Circuit: 2; Output Type: 开路漏极；推挽式; Operating Temperature: -40℃~+85℃; Features: 自动方向检测
U9 = CP2102-GMR: 应用功能:收发器;接口协议:USB;数据速率:1Mbps;; Supplier Part: C6568; Manufacturer: SKYWORKS/SILICON LABS(芯科); Supplier Footprint: WQFN-28-EP(5x5); JLCPCB Part Class: 扩展库; Datasheet: https://atta.szlcsc.com/upload/public/pdf/source/20170103/1483439882795.pdf; Supplier: LCSC; Applications Function: 收发器; Protocol: USB; Supply Voltage: 3V~3.6V; Data Rate: 1Mbps
U33 = PZ2.54-2*20: 插针结构:2x20P;间距:2.54mm;安装方式:直插;排数:双排;总PIN位数:40P;触头镀层:金;; LCSC Part Name: 2x20P 间距:2.54mm 直插; Supplier Part: C5224014; Manufacturer: ZHOURI(洲日); Supplier Footprint: 插件,P=2.54mm; JLCPCB Part Class: 扩展库; Datasheet: https://atta.szlcsc.com/upload/public/pdf/source/20221102/7E8316C38DB6D81BB18273F4CFF8B2F6.pdf; Supplier: LCSC; Pin Structure: 2x20P; Pitch: 2.54mm; Mounting Type: 直插; Number of Rows: 双排; Number of Pins: 40P; Contact Plating: 金
UART1 = HC-TYPE-C-16P-01A-R: 连接器类型:Type-C;公母:母座;触点数量:16;端口数量:1;安装方式:卧贴;; LCSC Part Name: Type-C 母座 卧贴; Supplier Part: C2997433; Manufacturer: HCTL(华灿天禄); Supplier Footprint: SMD; Datasheet: https://atta.szlcsc.com/upload/public/pdf/source/20220415/23B51DCADC5F28223C40C3605487ACA1.pdf; Supplier: LCSC; Connector Type: Type-C; Gender: 母座; Number of Contacts: 16; Number of Ports: 1; Mounting Style: 卧贴
LED1 = KT-0603R: 发光颜色:红色;功率:-;正向电流:-;主波长:-;二极管配置:-;透镜颜色:-;色温:-;发光角度:-;载带方式:-;工作温度:-40℃~+85℃;; LCSC Part Name: 0603 红灯 高亮; Supplier Part: C2286; Manufacturer: KENTO; Supplier Footprint: 0603; JLCPCB Part Class: Basic Part; Datasheet: https://atta.szlcsc.com/upload/public/pdf/source/20160616/1466072038404.pdf; Supplier: LCSC; Emitted Color: 红色; Operating Temperature: -40℃~+85℃
R5 R7 R10 R16 R19 = RMC 0402 0R N: 阻值:0Ω;精度:±1%;功率:-;; LCSC Part Name: 0Ω ±1%; Supplier Part: C325377; Manufacturer: Tyohm(幸亚电阻); Supplier Footprint: 0402; JLCPCB Part Class: Extended Part; Datasheet: https://atta.szlcsc.com/upload/public/pdf/source/20190115/C325956_D27151D492FFB3C9AB4A6F14FE01F30A.pdf; Supplier: LCSC; Tolerance: ±1%; Check: false
R6 = RC0402FR-078K06L: 电阻类型:厚膜电阻;阻值:8.06kΩ;精度:±1%;功率:62.5mW;最大工作电压:50V;温度系数:±100ppm/℃;; LCSC Part Name: 厚膜电阻 8.06kΩ ±1% 62.5mW; Supplier Part: C276278; Manufacturer: YAGEO(国巨); Supplier Footprint: 0402; JLCPCB Part Class: Extended Part; Datasheet: https://atta.szlcsc.com/upload/public/pdf/source/20180904/C276339_014E484F1DBA106FB92D45EABD5A1AC1.pdf; Supplier: LCSC; Type: 厚膜电阻; Tolerance: ±1%; Power(Watts): 62.5mW; Overload Voltage (Max): 50V; Temperature Coefficient: ±100ppm/℃; Operating Temperature Range: -55℃~+155℃
R8 = RC0402FR-0756KL: 电阻类型:厚膜电阻;阻值:56kΩ;精度:±1%;功率:62.5mW;最大工作电压:50V;温度系数:±100ppm/℃;; LCSC Part Name: 厚膜电阻 56kΩ ±1% 62.5mW; Supplier Part: C114756; Manufacturer: YAGEO(国巨); Supplier Footprint: 0402; JLCPCB Part Class: Extended Part; Datasheet: https://atta.szlcsc.com/upload/public/pdf/source/20180821/C275644_0D56F95EFF785E7D9A1FEF436B37DA78.pdf; Supplier: LCSC; Type: 厚膜电阻; Tolerance: ±1%; Power(Watts): 62.5mW; Overload Voltage (Max): 50V; Temperature Coefficient: ±100ppm/℃; Operating Temperature Range: -55℃~+155℃
R9 = 0402WGF1001TCE: 电阻类型:厚膜电阻;阻值:1kΩ;精度:±1%;功率:62.5mW;最大工作电压:50V;温度系数:±100ppm/℃;; LCSC Part Name: 1kΩ ±1% 62.5mW 厚膜电阻; Supplier Part: C11702; Manufacturer: UNI-ROYAL(厚声); Supplier Footprint: 0402; JLCPCB Part Class: Basic Part; Datasheet: https://atta.szlcsc.com/upload/public/pdf/source/20200306/C422600_1E6D84923E4A46A82E41ADD87F860B5C.pdf; Supplier: LCSC; Type: 厚膜电阻; Tolerance: ±1%; Power(Watts): 62.5mW; Overload Voltage (Max): 50V; Temperature Coefficient: ±100ppm/℃; Operating Temperature Range: -55℃~+155℃
R12 R13 R20 R36 R39 = 0402WGF1002TCE: 电阻类型:厚膜电阻;阻值:10kΩ;精度:±1%;功率:62.5mW;最大工作电压:50V;温度系数:±100ppm/℃;; LCSC Part Name: 10kΩ ±1% 62.5mW 厚膜电阻; Supplier Part: C25744; Manufacturer: UNI-ROYAL(厚声); Supplier Footprint: 0402; JLCPCB Part Class: Basic Part; Datasheet: https://atta.szlcsc.com/upload/public/pdf/source/20200306/C422600_1E6D84923E4A46A82E41ADD87F860B5C.pdf; Supplier: LCSC; Type: 厚膜电阻; Tolerance: ±1%; Power(Watts): 62.5mW; Overload Voltage (Max): 50V; Temperature Coefficient: ±100ppm/℃; Operating Temperature Range: -55℃~+155℃
R17 = 0402WGF2612TCE: 电阻类型:厚膜电阻;阻值:26.1kΩ;精度:±1%;功率:62.5mW;最大工作电压:50V;温度系数:±100ppm/℃;; LCSC Part Name: 26.1kΩ ±1% 62.5mW 厚膜电阻; Supplier Part: C25875; Manufacturer: UNI-ROYAL(厚声); Supplier Footprint: 0402; JLCPCB Part Class: Extended Part; Datasheet: https://atta.szlcsc.com/upload/public/pdf/source/20200306/C422600_1E6D84923E4A46A82E41ADD87F860B5C.pdf; Supplier: LCSC; Type: 厚膜电阻; Tolerance: ±1%; Power(Watts): 62.5mW; Overload Voltage (Max): 50V; Temperature Coefficient: ±100ppm/℃; Operating Temperature Range: -55℃~+155℃
SW9 = SS-12D10L5: 电路结构:单刀双掷;安装方式:直插;开关颜色:黑色;额定电流(DC):3A;额定电压(DC):125V;额定电流(AC):3A;额定电压(AC):125V;机械寿命:1万次;; LCSC Part Name: 柄长5mm 直插双档 滑动开关; Supplier Part: C319012; Manufacturer: XKB Connectivity(中国星坤); Supplier Footprint: 插件; JLCPCB Part Class: 扩展库; Datasheet: https://atta.szlcsc.com/upload/public/pdf/source/20211009/D6412F37AABE6F9459A6EE7FA4DAEADB.pdf; Supplier: LCSC; Circuit: 单刀双掷; Actuator Style: 矩形柱状; Pin Style: PC引脚; Switch Length: 13mm; Switch Width: 6.8mm; Switch Height: 6.4mm; Mounting Style: 直插; Actuator Color: 黑色; Current Rating (DC): 3A; Voltage Rating (DC): 125V; Current Rating (AC): 3A; Voltage Rating (AC): 125V; Mechanical Life: 1万次; Operating Temperature: -40℃~+85℃
U7 U8 U10 = RT2515HGSP: 输出类型:可调;最大输入电压:6V;输出电压:900mV~5.5V;最大输出电流:2A;电源纹波抑制比(PSRR):-;输出极性:正极;; LCSC Part Name: ADJ 输入6V 输出0.9V~5.5V 2A; Supplier Part: C242642; Manufacturer: RICHTEK(立锜); Supplier Footprint: SOP-8-EP; JLCPCB Part Class: 扩展库; Datasheet: https://atta.szlcsc.com/upload/public/pdf/source/20180629/C242642_AA21D3527C20C70CB74C1AE5985AD0C2.pdf; Supplier: LCSC; Output Type: 可调; Maximum Input Voltage: 6V; Output Voltage: 900mV~5.5V; MAX Output Current: 2A; Dropout Voltage: 400mV@(2A); Output Polarity: 正极; Number of Outputs: 1
U11 = SMD0805B050TF: 最大电压:6V;最大电流:100A;保持电流:500mA;跳闸电流:1A;; LCSC Part Name: 6V 500mA 0805自恢复; Supplier Part: C269104; Manufacturer: Brightking(君耀电子); Supplier Footprint: 0805; JLCPCB Part Class: 扩展库; Datasheet: https://atta.szlcsc.com/upload/public/pdf/source/20180913/C269107_1BF28CF6F4C5BFD5B8CD673BC8D2B923.pdf; Supplier: LCSC; Operating Voltage (Max): 6V; Current Rating (Max): 100A; Hold Current: 500mA; Trip Current: 1A; Resistance - Initial (Ri) (Min): 150mΩ; Maximum Time to Trip: 100ms; Operating Temperature: -40℃~+85℃；-40℃~+85℃；-40℃~+85℃
C3 C35 = GJM1555C1H150FB01D: 容值:15pF;精度:±1%;额定电压:50V;材质(温度系数):C0G;; LCSC Part Name: 15pF ±1% 50V; Supplier Part: C441742; Manufacturer: muRata(村田); Supplier Footprint: 0402; JLCPCB Part Class: Extended Part; Datasheet: https://atta.szlcsc.com/upload/public/pdf/source/20200305/C490387_23319AE8C154DEB24C505E6C82A8106A.pdf; Supplier: LCSC; Tolerance: ±1%; Voltage Rated: 50V; Temperature Coefficient: C0G
C36-C47 C51-C70 = GRM033R61E104KE14D: 容值:100nF;精度:±10%;额定电压:25V;材质(温度系数):X5R;; LCSC Part Name: 100nF ±10% 25V; Supplier Part: C76939; Manufacturer: muRata(村田); Supplier Footprint: 0201; JLCPCB Part Class: Extended Part; Datasheet: https://atta.szlcsc.com/upload/public/pdf/source/20180307/C76939_15204091018551407727.pdf; Supplier: LCSC; Tolerance: ±10%; Voltage Rated: 25V; Temperature Coefficient: X5R
C48 = GRM155R71H223KA12D: 容值:22nF;精度:±10%;额定电压:50V;材质(温度系数):X7R;; LCSC Part Name: 22nF ±10% 50V; Supplier Part: C77023; Manufacturer: muRata(村田); Supplier Footprint: 0402; JLCPCB Part Class: Extended Part; Datasheet: https://atta.szlcsc.com/upload/public/pdf/source/20180326/C77023_485AB0D0559A254D360F85D8E7719291.pdf; Supplier: LCSC; Tolerance: ±10%; Voltage Rated: 50V; Temperature Coefficient: X7R
C50 = CC0402KRX7R9BB103: 容值:10nF;精度:±10%;额定电压:50V;材质(温度系数):X7R;; LCSC Part Name: 10nF ±10% 50V; Supplier Part: C60133; Manufacturer: YAGEO(国巨); Supplier Footprint: 0402; JLCPCB Part Class: Extended Part; Datasheet: https://atta.szlcsc.com/upload/public/pdf/source/20180224/C181747_15194369449651363981.pdf; Supplier: LCSC; Tolerance: ±10%; Voltage Rated: 50V; Temperature Coefficient: X7R
L1 L2 = CBW201209U601T: 标称阻抗@测试频率:600Ω@100MHz;误差:±25%;直流电阻(RDC):250mΩ;; LCSC Part Name: 单路 0805磁珠 阻抗600Ω@100MHz; Supplier Part: C21286; Manufacturer: FH(风华); Supplier Footprint: 0805; JLCPCB Part Class: 扩展库; Datasheet: https://atta.szlcsc.com/upload/public/pdf/source/20190129/C361676_507080CDC8DBC2B0B7C2139C1873642D.pdf; Supplier: LCSC; Impedance @ Frequency: 600Ω@100MHz; Tolerance: ±25%; DC Resistance: 250mΩ; Current Rating: 1.5A; Circuits: 1
OSC1 = OT2EL4C4JI-111OLP-12.288M: 频率:12.288MHz;常温频差:±10ppm;输出模式:CMOS;工作电压:1.8V~3.3V;; LCSC Part Name: 12.288MHZ 1.8V-3.3V ±10PPM YSO110TR; Supplier Part: C5203546; Manufacturer: YXC(扬兴晶振); Supplier Footprint: SMD3225-4P; JLCPCB Part Class: 扩展库; Datasheet: https://atta.szlcsc.com/upload/public/pdf/source/20221021/725757C58D568D13D3CA67A21B90FA19.pdf; Supplier: LCSC; Normal temperature Frequency Tolerance: ±10ppm; Output Type: CMOS; Supply Voltage: 1.8V~3.3V; Operating Temperature: -40℃~+85℃
R37 = SCR0402F14K: 电阻类型:厚膜电阻;阻值:14kΩ;精度:±1%;功率:62.5mW;最大工作电压:50V;; LCSC Part Name: 厚膜电阻 14kΩ ±1% 62.5mW; Supplier Part: C3015834; Manufacturer: VO(翔胜); Supplier Footprint: 0402; JLCPCB Part Class: Extended Part; Datasheet: https://atta.szlcsc.com/upload/public/pdf/source/20220513/247AF9639BA21CF93567DC289CCC6A22.pdf; Supplier: LCSC; Type: 厚膜电阻; Tolerance: ±1%; Power(Watts): 62.5mW; Overload Voltage (Max): 50V; Operating Temperature Range: -55℃~+155℃
RN1 RN2 = 4D03WGJ0103T5E: 电阻器数:4;阻值:10kΩ;精度:±5%;单个元件功率:62.5mW;温度系数:±200ppm/℃;; LCSC Part Name: 10kΩ ±5%; Supplier Part: C29718; Manufacturer: UNI-ROYAL(厚声); Supplier Footprint: 0603x4; JLCPCB Part Class: Basic Part; Datasheet: https://atta.szlcsc.com/upload/public/pdf/source/20191224/C474318_2527498AE30E813171187CCD28401A71.pdf; Supplier: LCSC; Number of Resistors: 4; Tolerance: ±5%; Power(Watts): 62.5mW; Temperature Coefficient: ±200ppm/℃; Number of Pins: 8
S2-S5 = LSPi_m3: Check: false
SW3 = KH-6X6X5H-STM: 电路结构:单刀单掷;按钮形状:圆形按钮;安装方式:立贴;开关长度:6mm;开关宽度:6mm;开关高度:5mm;带支架:不带;触点电流:50mA;额定电压(DC):12V;机械寿命:8万次;; LCSC Part Name: 6*6*5mm 立贴 轻触开关; Supplier Part: C2837531; Manufacturer: kinghelm(金航标); Supplier Footprint: SMD; JLCPCB Part Class: 扩展库; Datasheet: https://atta.szlcsc.com/upload/public/pdf/source/20210608/C2837531_45E87AB996CE723B09405FF2EA209C4C.pdf; Supplier: LCSC; Circuit: 单刀单掷; Actuator Style: 圆形按钮; Mounting Style: 立贴; Switch Length: 6mm; Switch Width: 6mm; Switch Height: 5mm; Strike Gundam: 不带; Contact Current: 50mA; Voltage Rating (DC): 12V; Actuator/Cap Color: 黑色; Pin Style: 鸥翼型; Mechanical Life: 8万次
TP1-TP3 = Test-Point: Test Point 测试点; Check: false
U1 = YSYX_20250210: Check: false
U3 = TPS3808G01DBVR: 输入电压:1.7V~6.5V;复位有效电平:低电平有效;受监控电压数:1;复位超时:20ms;; LCSC Part Name: 低静态电流可编程延迟监控电路; Supplier Part: C19653; Manufacturer: TI(德州仪器); Supplier Footprint: SOT-23-6; JLCPCB Part Class: 扩展库; Datasheet: https://www.ti.com/cn/lit/gpn/tps3808; Supplier: LCSC; ChipType: 电压监控器; Output Type: 开漏; Input Voltage: 1.7V~6.5V; Reset Active Level: 低电平有效; Threshold Voltage: 405mV; Number of Voltages Monitored: 1; Manual Reset: 有; Watchdog: 无; Reset Timeout: 20ms; Operating Temperature: -40℃~+125℃@(TJ)
U34 = DSHP05TSGER_C3293145: 电路结构:单刀单掷;开关位数:5位;额定电流:25mA;额定电压:24V;使用寿命:3千次;颜色:黑色;; LCSC Part Name: 5位 1.27mm间距SMD KE拨码开关 DIPswitch; Supplier Part: C3293145; Manufacturer: 康深; Supplier Footprint: SMD-10P,5.4x7.9mm; JLCPCB Part Class: 扩展库; Datasheet: https://atta.szlcsc.com/upload/public/pdf/source/20220713/A60E769B1887052A7FF0FAA9E3A7CA10.pdf; Supplier: LCSC; Circuit: 单刀单掷; Number of Positions: 5位; Lead Pitch: 1.27mm; Current Rating: 25mA; Voltage Rating: 24V; Operating Temperature: -30℃~+85℃; Operating Life: 3千次; Color: 黑色
U40 = DSHP04TSGER_C3293144: 电路结构:单刀单掷;开关位数:4位;额定电流:25mA;额定电压:24V;使用寿命:3千次;颜色:黑色;; LCSC Part Name: 4位 1.27mm间距贴片型 KE拨码开关; Supplier Part: C3293144; Manufacturer: 康深; Supplier Footprint: SMD-8P,5.4x6.6mm; JLCPCB Part Class: 扩展库; Datasheet: https://atta.szlcsc.com/upload/public/pdf/source/20220713/C53382FBC579242FFD9AC69EAEDF7542.pdf; Supplier: LCSC; Circuit: 单刀单掷; Number of Positions: 4位; Lead Pitch: 1.27mm; Current Rating: 25mA; Voltage Rating: 24V; Operating Temperature: -30℃~+85℃; Operating Life: 3千次; Color: 黑色
X1 = OT322525MJBA4SL: 频率:25MHz;工作电压:1.8V~3.3V;供电电流:5mA;频率稳定度(全温):±10ppm;; LCSC Part Name: 25MHz ±10ppm 1.8V~3.3V YSO110TR; Supplier Part: C669088; Manufacturer: YXC(扬兴晶振); Supplier Footprint: SMD3225-4P; JLCPCB Part Class: 扩展库; Datasheet: https://atta.szlcsc.com/upload/public/pdf/source/20210329/C669065_30B18CFE780D377BA4E84F6ED1951959.pdf; Supplier: LCSC; Supply Voltage: 1.8V~3.3V; Supply Current (Max): 5mA; Frequency Stability(Full temperature range): ±10ppm; Operating Temperature: -40℃~+85℃

## Nets
3V3_RXD: R14.2 U6.1(B2)
3V3_TXD: R15.2 U6.8(B1)
GND: C1.2 C2.2 C3.2 C4.2 C5.2 C6.1 C7.1 C8.1 C9.1 C10.1 C11.1 C12.1 C13.1 C14.1 C15.1 C16.1 C17.1 C18.2 C19.1 C20.1 C21.1 C22.1 C23.2 C24.2 C25.2 C26.1 C27.1 C28.1 C29.1 C30.1 C31.1 C32.2 C33.1 C34.1 C35.1 C36.1 C37.1 C38.1 C39.1 C40.1 C41.1 C42.1 C43.1 C44.1 C45.1 C46.1 C47.1 C48.1 C49.1 C50.1 C51.1 C52.1 C53.1 C54.1 C55.1 C56.1 C57.1 C58.1 C59.1 C60.1 C61.1 C62.1 C63.1 C64.1 C65.1 C66.1 C67.1 C68.1 C69.1 C70.1 C84.2 C85.2 C86.2 C87.1 CN1.1 CN1.4 CN1.7 CN1.10 CN1.13 CN1.16 CN1.17 CN1.24 CN1.31 CN1.38 CN1.46 CN1.55 CN1.63 CN1.70 CN1.77 CN1.84 CN1.85 CN1.88 CN1.91 CN1.94 CN1.97 CN1.100 CN2.3 CN2.6 CN2.7 CN2.8 CN2.16 CN2.23 CN2.30 CN2.37 CN2.44 CN2.57 CN2.64 CN2.71 CN2.78 CN2.85 CN2.93 CN2.94 CN2.95 CN2.98 CN5.8 CN5.15 CN5.22 CN5.29 CN5.36 CN5.44 CN5.45 CN5.48 CN5.53 CN5.56 CN5.57 CN5.65 CN5.72 CN5.79 CN5.86 CN5.93 CN6.4 CN6.9 CN6.14 CN6.19 CN6.24 CN6.29 CN6.34 CN6.43 CN6.44 CN6.45 CN6.56 CN6.57 CN6.58 CN6.67 CN6.72 CN6.77 CN6.82 CN6.87 CN6.92 CN6.97 D2.3(GND) D2.8(GND) OSC1.2(GND) OSC5.2(GND) R5.2 R7.2 R12.2 R13.2 R16.2 R18.2 R20.2 R21.2 R22.1 R36.2 R39.2 R125.2 R131.1 R132.1 R133.1 R134.1 R137.2 R138.2 RN1.1 RN1.2 RN1.3 RN1.4 RN2.1 RN2.2 RN2.3 RN2.4 S2.1 S3.1 S4.1 S5.1 SW3.1 SW12.2 SW13.2 U1.1(VSS) U1.2(VSS) U1.3(VSS) U1.4(VSS) U1.8(VSSIO) U1.20(VSS) U1.21(VSS) U1.24(VSSIO) U1.45(VSS) U1.48(VSS) U1.50(VSSIO) U1.51(VSS) U1.53(VSS) U1.54(VSSIO) U1.77(VSS) U1.80(VSS) U1.81(VSSIO) U1.89(VSSIO) U1.93(VSS) U1.94(VSS) U1.113(VSSIO) U1.116(VSS) U1.117(VSS) U1.129(VSSIO) U1.133(VSS) U1.134(VSS) U1.136(VSSIO) U1.140(VSS) U1.141(VSS) U1.156(VSSIO) U1.162(VSSIO) U1.170(VSSIO) U1.171(VSS) U1.173(VSS) U3.2(GND) U6.2(GND) U7.8(GND) U7.9(GND) U8.8(GND) U8.9(GND) U9.3(GND) U9.29(EP) U10.8(GND) U10.9(GND) U16.2 U16.10 U33.34 U33.36 U33.38 U33.40 UART1.1(SHELL) UART1.2(SHELL) UART1.3(SHELL) UART1.4(SHELL) UART1.A1B12(GND) UART1.B1A12(GND) X1.2(GND) ; also on sheet 6 7
VCC_0V9: C6.2 C7.2 C8.2 C9.2 C51.2 C52.2 C53.2 C54.2 C55.2 C56.2 C57.2 C58.2 C59.2 C60.2 C61.2 C62.2 C63.2 C64.2 C65.2 C66.2 C67.2 C68.2 C69.2 C70.2 R6.1 U1.5(VDD) U1.6(VDD) U1.22(VDD) U1.23(VDD) U1.46(VDD) U1.49(VDD) U1.52(VDD) U1.55(VDD) U1.79(VDD) U1.82(VDD) U1.91(VDD) U1.92(VDD) U1.114(VDD) U1.115(VDD) U1.131(VDD) U1.132(VDD) U1.138(VDD) U1.139(VDD) U1.169(VDD) U1.172(VDD) U7.6(VOUT)
VCC_1V8: C4.1 C26.2 C27.2 C28.2 C29.2 C36.2 C37.2 C38.2 C39.2 C40.2 C41.2 C42.2 C43.2 C44.2 C45.2 C46.2 C47.2 C49.2 C85.1 CN2.1 CN2.2 CN2.4 CN2.5 CN2.96 CN2.97 CN2.99 CN2.100 CN5.46 CN5.47 CN5.49 CN5.50 CN5.51 CN5.52 CN5.54 CN5.55 L1.1 L2.1 OSC5.1(Tri-state) OSC5.4(VDD) R9.2 R11.1 R17.1 R26.2 R27.2 R29.2 R30.2 R31.2 R32.2 R33.2 R34.2 R35.2 R37.1 R38.1 R129.2 R148.2 U1.7(VDDIO) U1.25(VDDIO) U1.47(VDDIO) U1.56(VDDIO) U1.83(VDDIO) U1.84(VDDIO) U1.90(VDDIO) U1.112(VDDIO) U1.130(VDDIO) U1.137(VDDIO) U1.159(VDDIO) U1.168(VDDIO) U3.6(VDD) U6.3(VCCA) U10.6(VOUT) ; also on sheet 6 7
VCC_3V3: C5.1 C10.2 C11.2 C12.2 C13.2 C87.2 LED1.2(A) R8.1 R130.1 R135.2 R136.2 U6.7(VCCB) U8.6(VOUT) U16.4 ; also on sheet 6 7
VCC_5V: C14.2 C15.2 C16.2 C17.2 C19.2 C20.2 C21.2 C22.2 C30.2 C31.2 CN6.46 CN6.47 CN6.48 CN6.49 CN6.50 CN6.51 CN6.52 CN6.53 CN6.54 CN6.55 R10.2 R19.2 R24.1 U7.3(VIN) U8.3(VIN) U10.3(VIN) U11.2 U33.33 U33.35 U33.37 U33.39 ; also on sheet 7
B13_L11_N: CN2.75
B13_L11_P: CN2.74
B35_L1_N: CN1.43 U1.126(old_ip_chiplink_rx_data_i_pad0)
B35_L1_P: CN1.44 U1.127(old_ip_chiplink_rx_send_i_pad)
B35_L2_N: CN1.39 U1.122(old_ip_chiplink_rx_data_i_pad4)
B35_L2_P: CN1.40 U1.123(old_ip_chiplink_rx_data_i_pad7)
B35_L4_N: CN1.41 U1.124(old_ip_chiplink_rx_data_i_pad6)
B35_L4_P: CN1.42 U1.125(old_ip_chiplink_rx_clk_i_pad)
B35_L5_N: CN1.34 U1.118(old_ip_chiplink_rx_data_i_pad1)
B35_L5_P: CN1.35 U1.119(old_ip_chiplink_rx_data_i_pad3)
B35_L6_N: CN1.36 U1.120(old_ip_chiplink_rx_data_i_pad2)
B35_L6_P: CN1.37 U1.121(old_ip_chiplink_rx_data_i_pad5)
B35_L14_N: CN1.29 U1.16(old_ip_chiplink_tx_data_o_pad0)
B35_L14_P: CN1.30 U1.17(old_ip_chiplink_tx_send_o_pad)
B35_L19_N: CN1.27 U1.14(old_ip_chiplink_tx_data_o_pad2)
B35_L19_P: CN1.28 U1.15(old_ip_chiplink_tx_data_o_pad1)
B35_L20_N: CN1.32 U1.18(old_ip_chiplink_tx_rst_o_pad)
B35_L20_P: CN1.33 U1.19(old_ip_chiplink_tx_clk_o_pad)
B35_L21_N: CN1.25 U1.12(old_ip_chiplink_tx_data_o_pad3)
B35_L21_P: CN1.26 U1.13(old_ip_chiplink_tx_data_o_pad4)
B35_L23_P: CN1.21 U1.9(old_ip_chiplink_tx_data_o_pad7)
B35_L24_N: CN1.22 U1.10(old_ip_chiplink_tx_data_o_pad5)
B35_L24_P: CN1.23 U1.11(old_ip_chiplink_tx_data_o_pad6)
B35_L25: CN1.45 U1.128(old_ip_chiplink_rx_rst_i_pad)
CLK_CFG_I_PAD0: RN1.6 U1.165(clk_cfg_i_pad0) U40.7
CLK_CFG_I_PAD1: RN1.7 U1.166(clk_cfg_i_pad1) U40.6
CLK_CFG_I_PAD2: RN1.8 U1.163(clk_cfg_i_pad2) U40.5
CLK_TEST_O_PAD: TP3.1 U1.150(clk_test_o_pad)
CORE_SEL_I_PAD0: R36.1 U1.155(core_sel_i_pad0) U34.1(A1)
CORE_SEL_I_PAD1: RN2.8 U1.154(core_sel_i_pad1) U34.2(A2)
CORE_SEL_I_PAD2: RN2.7 U1.153(core_sel_i_pad2) U34.3(A3)
CORE_SEL_I_PAD3: RN2.6 U1.152(core_sel_i_pad3) U34.4(A4)
CORE_SEL_I_PAD4: RN2.5 U1.151(core_sel_i_pad4) U34.5(A5)
EXT_RST_N_I_PAD: R40.1 U1.167(ext_rst_n_i_pad)
FPGA_TCK: CN1.50 D2.5(I/O4) D2.6(NC) U16.1
FPGA_TDI: CN1.48 D2.1(I/O1) D2.10(NC) U16.9
FPGA_TDO: CN1.47 D2.4(I/O3) D2.7(NC) U16.3
FPGA_TMS: CN1.49 D2.2(I/O2) D2.9(NC) U16.5
GPIO_0_0: U1.57(gpio_0_gpio_io_pad0) U33.9
GPIO_0_1: U1.59(gpio_0_gpio_io_pad1) U33.10
GPIO_0_2: U1.58(gpio_0_gpio_io_pad2) ; also on sheet 7
GPIO_0_3: U1.60(gpio_0_gpio_io_pad3) ; also on sheet 7
GPIO_0_4: U1.61(gpio_0_gpio_io_pad4) ; also on sheet 7
GPIO_0_5: U1.62(gpio_0_gpio_io_pad5) ; also on sheet 7
GPIO_0_6: U1.63(gpio_0_gpio_io_pad6) U33.11
GPIO_0_7: U1.64(gpio_0_gpio_io_pad7) U33.12
GPIO_0_8: U1.65(gpio_0_gpio_io_pad8) U33.13
GPIO_0_9: U1.66(gpio_0_gpio_io_pad9) U33.14
GPIO_0_10: U1.67(gpio_0_gpio_io_pad10) U33.15
GPIO_0_11: U1.68(gpio_0_gpio_io_pad11) U33.16
GPIO_0_12: U1.69(gpio_0_gpio_io_pad12) U33.17
GPIO_0_13: U1.70(gpio_0_gpio_io_pad13) U33.18
GPIO_0_14: U1.71(gpio_0_gpio_io_pad14) U33.19
GPIO_0_15: U1.72(gpio_0_gpio_io_pad15) U33.20
GPIO_0_16: U1.73(gpio_0_gpio_io_pad16) U33.21
GPIO_0_17: U1.74(gpio_0_gpio_io_pad17) U33.22
GPIO_0_18: U1.76(gpio_0_gpio_io_pad18) U33.24
GPIO_0_19: U1.75(gpio_0_gpio_io_pad19) U33.23
GPIO_0_20: U1.78(gpio_0_gpio_io_pad20) U33.25
GPIO_0_21: U1.43(gpio_0_gpio_io_pad21) U33.7
GPIO_0_22: U1.44(gpio_0_gpio_io_pad22) U33.8
GPIO_0_23: U1.41(gpio_0_gpio_io_pad23) U33.5
GPIO_0_24: U1.42(gpio_0_gpio_io_pad24) U33.6
GPIO_0_25: U1.39(gpio_0_gpio_io_pad25) U33.3
GPIO_0_26: U1.40(gpio_0_gpio_io_pad26) U33.4
GPIO_0_27: U1.37(gpio_0_gpio_io_pad27) U33.1
GPIO_0_28: U1.38(gpio_0_gpio_io_pad28) U33.2
GPIO_0_29: U1.95(gpio_0_gpio_io_pad29) ; also on sheet 7
GPIO_0_30: U1.97(gpio_0_gpio_io_pad30) ; also on sheet 7
GPIO_0_31: U1.96(gpio_0_gpio_io_pad31) U33.26
GPIO_1_0: U1.99(gpio_1_gpio_io_pad0) ; also on sheet 7
GPIO_1_1: U1.98(gpio_1_gpio_io_pad1) ; also on sheet 7
GPIO_1_2: U1.101(gpio_1_gpio_io_pad2) ; also on sheet 7
GPIO_1_3: U1.100(gpio_1_gpio_io_pad3) U33.27
GPIO_1_4: U1.102(gpio_1_gpio_io_pad4) U33.28
GPIO_1_5: U1.103(gpio_1_gpio_io_pad5) U33.29
GPIO_1_6: U1.104(gpio_1_gpio_io_pad6) ; also on sheet 7
GPIO_1_7: U1.105(gpio_1_gpio_io_pad7) ; also on sheet 7
GPIO_1_8: U1.106(gpio_1_gpio_io_pad8) U33.30
GPIO_1_9: U1.107(gpio_1_gpio_io_pad9) U33.31
GPIO_1_10: U1.108(gpio_1_gpio_io_pad10) ; also on sheet 7
GPIO_1_11: U1.109(gpio_1_gpio_io_pad11) U33.32
GPIO_1_12: U1.110(gpio_1_gpio_io_pad12) ; also on sheet 7
GPIO_1_13: U1.111(gpio_1_gpio_io_pad13) ; also on sheet 7
MR: C84.1 CN1.51 R129.1 SW12.1
OLD_IP_UART_RX_I_PAD: U1.142(old_ip_uart_rx_i_pad) U6.4(A2)
OLD_IP_UART_TX_O_PAD: U1.143(old_ip_uart_tx_o_pad) U6.5(A1)
OSC_CLK_25M_I_PAD: R2.2 U1.160(osc_clk_25m_i_pad)
OSC_CLK_25M_O_PAD: TP1.1 U1.161(osc_clk_25m_o_pad)
OSC_CLK_12288K_I_PAD: R3.2 U1.157(osc_clk_12288k_i_pad)
OSC_CLK_12288K_O_PAD: TP2.1 U1.158(osc_clk_12288k_o_pad)
PL_CLK: CN5.61 R126.2
PLL_EN_I_PAD: RN1.5 U1.164(pll_en_i_pad) U40.8
PS_MIO2: CN6.32 R134.2
PS_MIO3: CN6.31 R133.2
PS_MIO4: CN6.30 R136.1 SW21.1
PS_MIO5: CN6.28 R135.1 SW21.2
PS_MIO6: CN6.27 R132.2
PS_MIO7: CN6.26 R131.2
PS_MIO8: CN6.25 R130.2
PS_SRST_B: C86.1 CN1.52 R148.1 SW13.1
PSRAM_0_CE_O_PAD: U1.32(psram_0_ce_o_pad)
PSRAM_0_DQS_PAD: U1.34(psram_0_dqs_pad)
PSRAM_0_IO_PAD0: U1.30(psram_0_io_pad0)
PSRAM_0_IO_PAD1: U1.29(psram_0_io_pad1)
PSRAM_0_IO_PAD2: U1.28(psram_0_io_pad2)
PSRAM_0_IO_PAD3: U1.27(psram_0_io_pad3)
PSRAM_0_IO_PAD4: U1.26(psram_0_io_pad4)
PSRAM_0_IO_PAD5: U1.35(psram_0_io_pad5)
PSRAM_0_IO_PAD6: U1.36(psram_0_io_pad6)
PSRAM_0_IO_PAD7: U1.33(psram_0_io_pad7)
PSRAM_0_SCK_O_PAD: U1.31(psram_0_sck_o_pad)
SOC_FLASH_CLK: U1.148(old_ip_spi_flash_clk_o_pad) ; also on sheet 6
SOC_FLASH_CS0: U1.146(old_ip_spi_flash_cs_o_pad0) ; also on sheet 6
SOC_FLASH_CS1: U1.147(old_ip_spi_flash_cs_o_pad1) ; also on sheet 6
SOC_FLASH_MISO: U1.145(old_ip_spi_flash_miso_i_pad) ; also on sheet 6
SOC_FLASH_MOSI: U1.144(old_ip_spi_flash_mosi_o_pad) ; also on sheet 6
SOC_UD+: U9.4(D+) ; also on sheet 6
SOC_UD-: U9.5(D-) ; also on sheet 6
UD+: UART1.A6(D+) UART1.B6(D+) ; also on sheet 6
UD-: UART1.A7(D-) UART1.B7(D-) ; also on sheet 6
USB_5V: C18.1 C32.1 SW9.2 UART1.A4B9(VBUS) UART1.B4A9(VBUS)
$2N1932: LED1.1(C) R22.2
$2N1936: R5.1 R9.1 U7.2(EN)
$2N1940: R6.2 R12.1 U7.7(ADJ)
$2N1944: R16.1 R19.1 U10.2(EN)
$2N1948: R17.2 R20.1 U10.7(ADJ)
$2N1951: R7.1 R10.1 U8.2(EN)
$2N1955: R8.2 R13.1 U8.7(ADJ)
$2N1961: SW9.3 U11.1
$3N4120: R1.2 X1.1(Enable/Disable)
$3N4121: C1.1 C2.1 L1.2 R1.1 X1.4(VDD)
$3N4122: C3.1 R2.1 X1.3(OUT)
$3N4128: C35.2 OSC1.3(OUT) R3.1
$3N4130: C33.2 C34.2 L2.2 OSC1.4(VDD) R4.1
$3N4133: OSC1.1(Tri-state) R4.2
$3N4140: C50.2 R37.2 R39.1 U3.5(SENSE)
$3N4141: R38.2 R40.2 U3.1(RESET)
$3N4147: SW3.3 U3.3(MR)
$3N4151: C48.2 U3.4(CT)
$3N4152: R35.1 U34.10(B1)
$3N4153: R34.1 U34.6(B5)
$3N4154: R33.1 U34.7(B4)
$3N4155: R32.1 U34.8(B3)
$3N4156: R31.1 U34.9(B2)
$3N4308: R26.1 U40.1
$3N4309: R27.1 U40.2
$3N4310: R29.1 U40.3
$3N4311: R30.1 U40.4
$4N1168: R137.1 SW21.3
$4N1169: R138.1 SW21.4
$4N1171: OSC5.3(OUT) R126.1
$5N3843: CN1.53 R125.1
$5N3930: R11.2 U6.6(OE)
$5N3946: R18.1 UART1.B5(CC2)
$5N3947: R21.1 UART1.A5(CC1)
$5N3956: C23.1 C24.1 R24.2 R25.1 U9.7(REGIN) U9.8(VBUS)
$5N3958: R25.2 U9.9(RST#)
$5N3959: C25.1 U9.6(VDD)
$5N3966: R14.1 U9.26(TXD)
$5N3969: R15.1 U9.25(RXD)

Not connected (* = marked no-connect by the designer): CN1 2* 3* 5* 6* 8* 9* 11* 12* 14* 15* 18 19 20 54* 56 57 58 59 60 61 62 64 65 66 67 68 69 71 72 73 74 75 76 78 79 80 81 82 83 86* 87* 89* 90* 92* 93* 95* 96* 98* 99*; CN2 9 10 11 12 13 14 15 17 18 19 20 21 22 24 25 26 27 28 29 31 32 33 34 35 36 38 39 40 41 42 43 45 46 47 48 49 50 51 52 53 54 55 56 58 59 60 61 62 63 65 66 67 68 69 70 72 73 76 77 79 80 81 82 83 84 86 87 88 89 90 91 92; CN5 1 2 3 4 5 6 7 9 10 11 12 13 14 16 17 18 19 20 21 23 24 25 26 27 28 30 31 32 33 34 35 37 38 39 40 41 42 43 58 59 60 62 63 64 66 67 68 69 70 71 73 74 75 76 77 78 80 81 82 83 84 85 87 88 89 90 91 92 94 95 96 97 98 99 100; CN6 1 2 3 5 6 7 8 10 11 12 13 15 16 17 18 20 21 22 23 33 35* 36* 37* 38* 39* 40* 41* 42* 59* 60* 61* 62* 63* 64* 65* 66* 68 69 70 71 73 74 75 76 78 79 80 81 83 84 85 86 88 89 90 91 93 94 95 96 98 99 100; SW3 2* 4*; SW9 1*; U1 85(NC)* 86(NC)* 87(NC)* 88(NC)* 135(NC)* 149(core_irq_i_pad)* 174(NC)* 175(NC)* 176(NC)*; U7 1(NC)* 4(NC)* 5(NC)*; U8 1(NC)* 4(NC)* 5(NC)*; U9 1(DCD)* 2(RI)* 10(NC)* 11(SUSPEND#)* 12(SUSPEND)* 13(NC)* 14(NC)* 15(NC)* 16(NC)* 17(NC)* 18(NC)* 19(NC)* 20(NC)* 21(NC)* 22(NC)* 23(CTS)* 24(RTS)* 27(DSR)* 28(DTR)*; U10 1(NC)* 4(NC)* 5(NC)*; U16 6* 7* 8*; UART1 A8(SBU1)* B8(SBU2)*

## Notes on the sheets
sheet 2
- 1.8V -> 0.9V <=> 3.3V
sheet 3
- CLK
- CHIP
- CONFIG_SWITCH
- VIT=0.972V, TD=125MS
- RESET
sheet 4
- JTAG
- POWER LEVEL
- BOOT MODE
- KEY
- PL_CLK
sheet 5
- FPGA接口
- TYPEC
